# EAGLE board PCB_ICBExt-R1.0-J36-CH01 (EAGLE 6.6.0), part 1 of 2
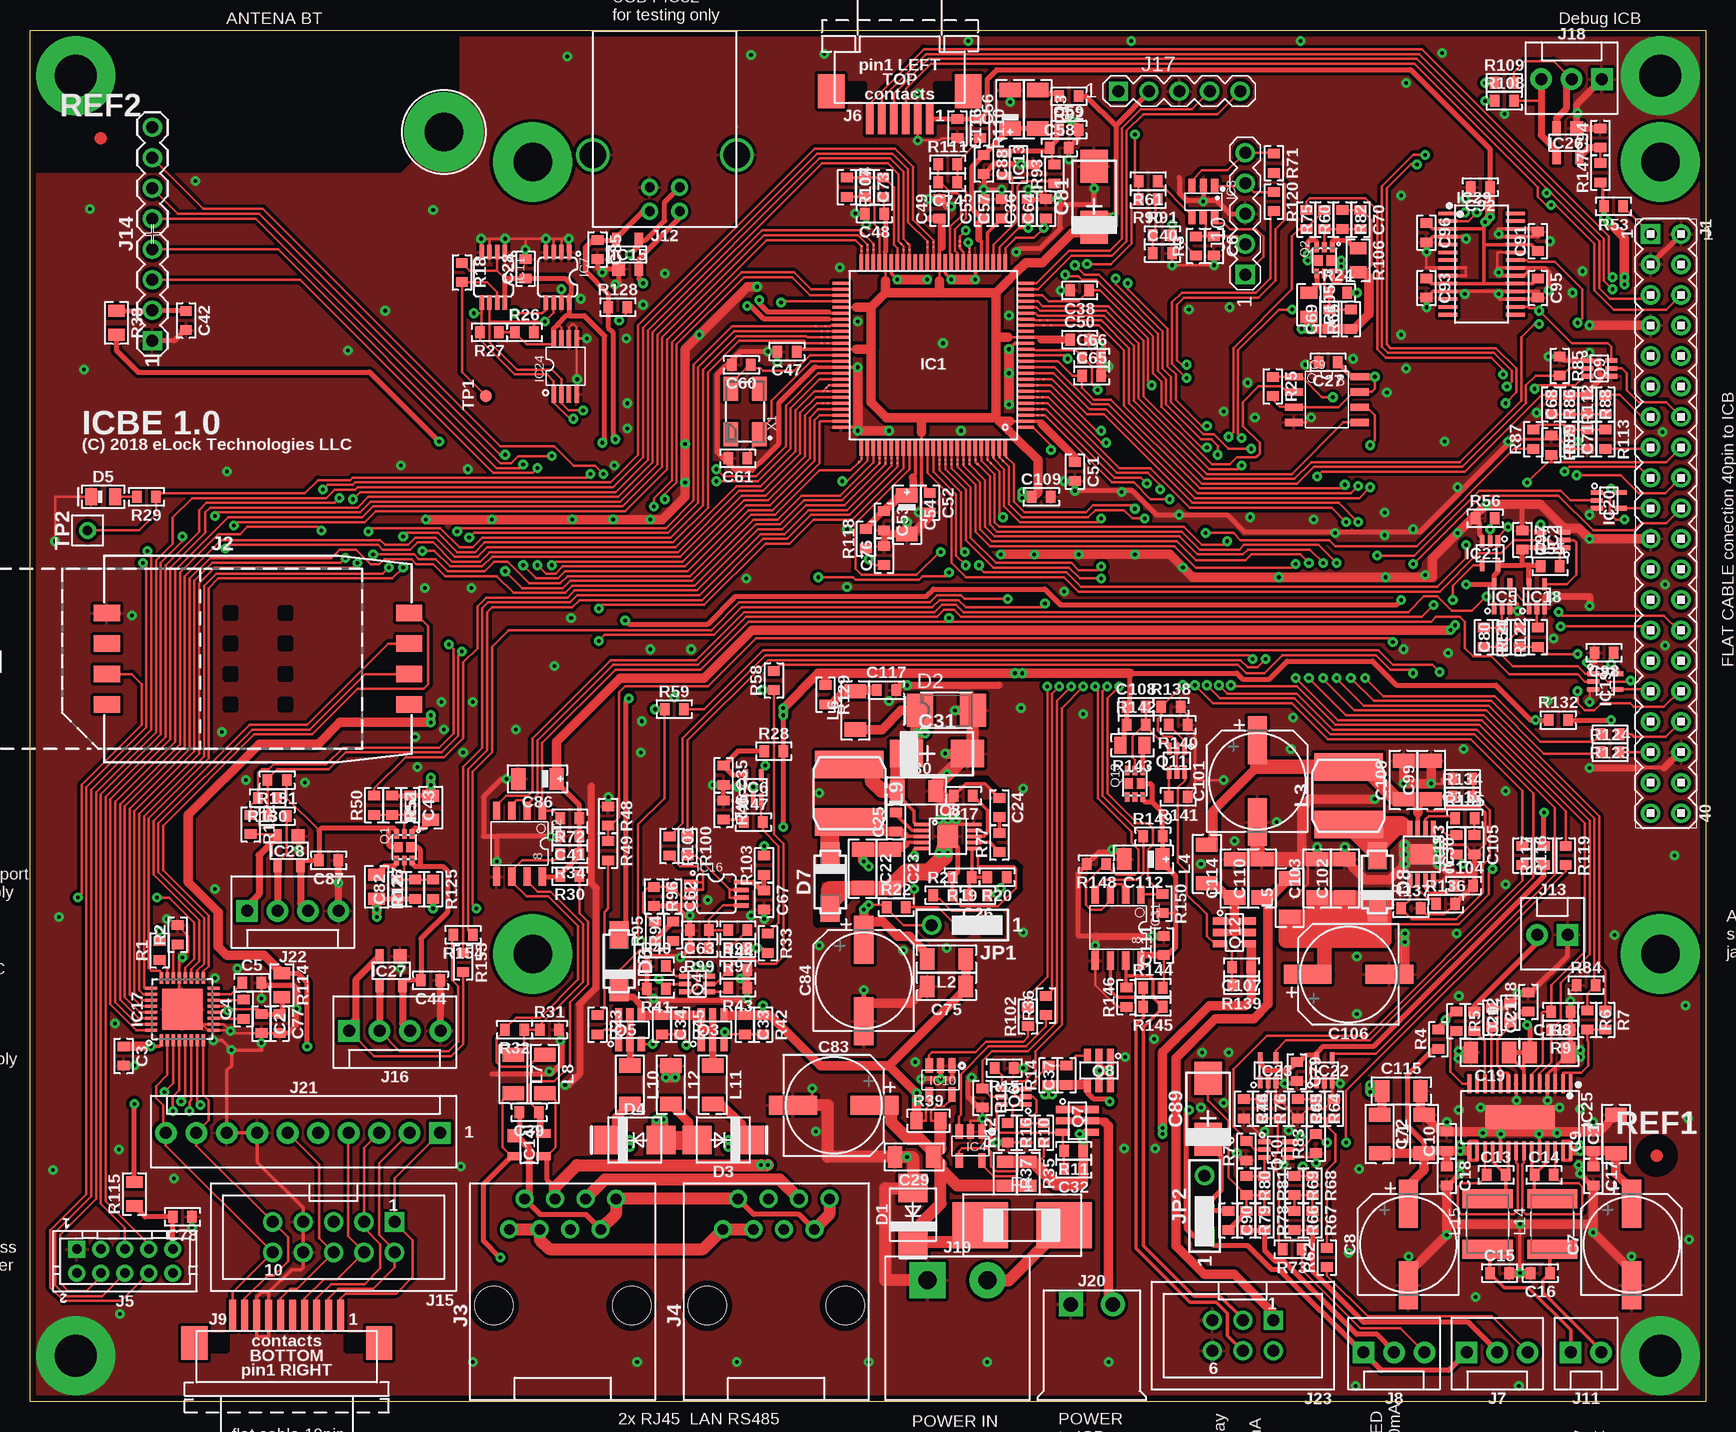
[diagram p7: board, top side]
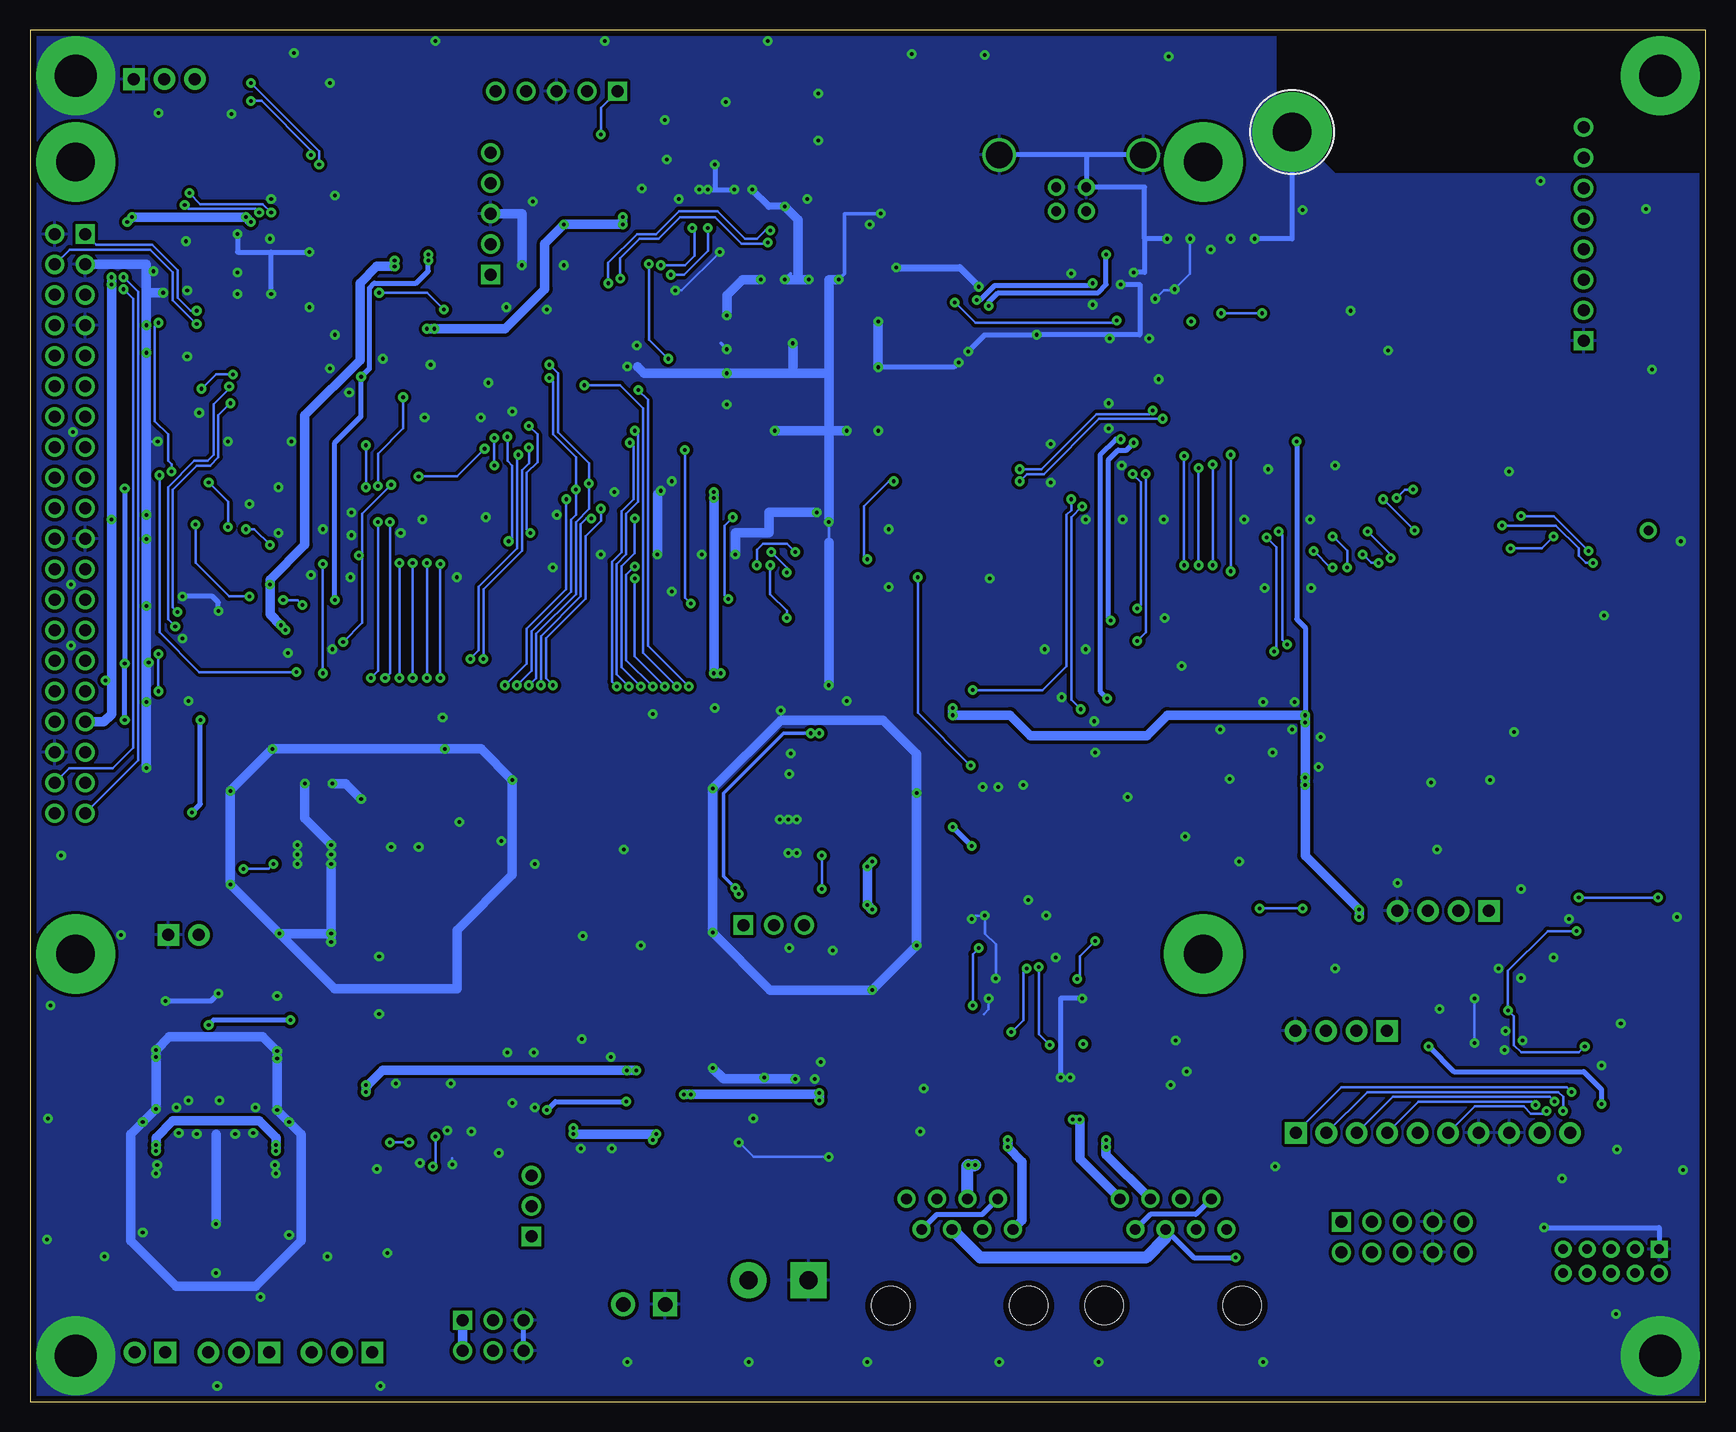
[diagram p8: board, bottom side, seen from below]

Size 139.7 x 114.3 mm. Coordinates in mm from the lower left corner, seen from the top.
Copper layers (1*16): Top 0.035mm / dielectric 1.5mm / Bottom 0.035mm
Design rules "ELOCK-ICBE-PAD-PAD-0,5-WIRE-PAD-0,3 *": minimum track width 0.2mm, minimum drill 0.3mm, track to track 0.2mm, track to pad 0.2mm, pad to pad 0.2mm, via to via 0.2mm, smd to smd 0.001mm, copper to edge 0.49mm, drill to drill 0.2mm, minimum pad ring 0.3mm, minimum via ring 0.25mm, stop-mask expansion 0.1mm, vias tented up to drill 0.6mm, thermal gap 0.27mm
Net classes: 1 HV: clearance 0.3 mm to class 0
tRestrict: area 9.9,107.3 to 30.9,114.3; 34 lines
bRestrict: area 9.9,107.3 to 30.9,114.3

## Footprints (pad centres in the part's own frame; a part is rotated, then mirrored left to right if it is on the bottom)
1206 = smd 1.19 x 1.79: 1 -1.6,0; 2 1.6,0
0603 = smd 0.79 x 0.99: 1 -0.8,0; 2 0.8,0
CAP_8MM_DIA_SMT = smd 1.59 x 3.99: 1 0,3.4; 2 0,-3.4
CT-C = smd 2.743 x 2.311: + -2.54,0; - 2.54,0
1206-POL-C = smd 1.19 x 1.79: + -1.6,0; - 1.6,0
SMB = smd 2.4 x 2.4: A 2.2,0; C -2.2,0
SMA = smd 2.159 x 2.743: + -2.311,0.003; - 2.108,-0.002
0805-POL-D = smd 0.99 x 1.39: A 1,0; K -1,0
SMA' = smd 2.21 x 1.575: A -2.223,0; K 2.223,0
LITTLEFUSE0154 = smd 4.6 x 3.8: 1 3.5,0; 2 -3.5,0
TQFP100_14X14_0,5MM = smd 1.39 x 0.28: 1 -7.7,6; 2 -7.7,5.5; 3 -7.7,5; 4 -7.7,4.5; 5 -7.7,4; 6 -7.7,3.5; 7 -7.7,3; 8 -7.7,2.5; 9 -7.7,2; 10 -7.7,1.5; 11 -7.7,1; 12 -7.7,0.5; 13 -7.7,0; 14 -7.7,-0.5; 15 -7.7,-1; 16 -7.7,-1.5; 17 -7.7,-2; 18 -7.7,-2.5; 19 -7.7,-3; 20 -7.7,-3.5; 21 -7.7,-4; 22 -7.7,-4.5; 23 -7.7,-5; 24 -7.7,-5.5; 25 -7.7,-6; 51 7.7,-6; 52 7.7,-5.5; 53 7.7,-5; 54 7.7,-4.5; 55 7.7,-4; 56 7.7,-3.5; 57 7.7,-3; 58 7.7,-2.5; 59 7.7,-2; 60 7.7,-1.5; 61 7.7,-1; 62 7.7,-0.5; 63 7.7,0; 64 7.7,0.5; 65 7.7,1; 66 7.7,1.5; 67 7.7,2; 68 7.7,2.5; 69 7.7,3; 70 7.7,3.5; 71 7.7,4; 72 7.7,4.5; 73 7.7,5; 74 7.7,5.5; 75 7.7,6 | smd 0.28 x 1.39: 26 -6,-7.7; 27 -5.5,-7.7; 28 -5,-7.7; 29 -4.5,-7.7; 30 -4,-7.7; 31 -3.5,-7.7; 32 -3,-7.7; 33 -2.5,-7.7; 34 -2,-7.7; 35 -1.5,-7.7; 36 -1,-7.7; 37 -0.5,-7.7; 38 0,-7.7; 39 0.5,-7.7; 40 1,-7.7; 41 1.5,-7.7; 42 2,-7.7; 43 2.5,-7.7; 44 3,-7.7; 45 3.5,-7.7; 46 4,-7.7; 47 4.5,-7.7; 48 5,-7.7; 49 5.5,-7.7; 50 6,-7.7; 76 6,7.7; 77 5.5,7.7; 78 5,7.7; 79 4.5,7.7; 80 4,7.7; 81 3.5,7.7; 82 3,7.7; 83 2.5,7.7; 84 2,7.7; 85 1.5,7.7; 86 1,7.7; 87 0.5,7.7; 88 0,7.7; 89 -0.5,7.7; 90 -1,7.7; 91 -1.5,7.7; 92 -2,7.7; 93 -2.5,7.7; 94 -3,7.7; 95 -3.5,7.7; 96 -4,7.7; 97 -4.5,7.7; 98 -5,7.7; 99 -5.5,7.7; 100 -6,7.7
SC70-5,SOT353,TSSOP5 = smd 0.39 x 0.99: 1 -0.65,-1; 2 0,-1; 3 0.65,-1; 4 0.65,1; 5 -0.65,1
SOT23-6 = smd 0.6 x 1.2: 1 -0.95,-1.3; 2 0,-1.3; 3 0.95,-1.3; 4 0.95,1.3; 5 0.003,1.3; 6 -0.95,1.3
SOT23-5 = smd 0.6 x 1.2: 1 -0.95,-1.206; 2 0,-1.206; 3 0.95,-1.206; 4 0.95,1.206; 5 -0.95,1.206
SC-70-5 = smd 0.39 x 0.99: 1 -0.65,-1; 2 0,-1; 3 0.65,-1; 4 0.65,1; 5 -0.65,1
MSOP-08 = smd 0.38 x 1.2: 1 -1,-2.1; 2 -0.35,-2.1; 3 0.3,-2.1; 4 0.95,-2.1; 5 0.95,2.1; 6 0.3,2.1; 7 -0.35,2.1; 8 -1,2.1
MSOP10EXP = smd 0.29 x 1.19: 1 -1,-2.2; 2 -0.5,-2.2; 3 0,-2.2; 4 0.5,-2.2; 5 1,-2.2; 6 1,2.2; 7 0.5,2.2; 8 0,2.2; 9 -0.5,2.2; 10 -1,2.2 | smd 1.88 x 1.68: EP 0,0
SO-08 = smd 0.61 x 1.524: 1 -1.905,-2.743; 2 -0.635,-2.743; 3 0.635,-2.743; 4 1.905,-2.743; 5 1.905,2.743; 6 0.635,2.743; 7 -0.635,2.743; 8 -1.905,2.743
SO08 = smd 0.61 x 1.524: 1 -1.905,-2.743; 2 -0.635,-2.743; 3 0.635,-2.743; 4 1.905,-2.743; 5 1.905,2.743; 6 0.635,2.743; 7 -0.635,2.743; 8 -1.905,2.743
SOT23 = smd 0.69 x 1.19: 1 0.95,1.2; 2 -0.95,1.2; 3 0,-1.2
SOT-143 = smd 1.09 x 1.19: 1 -0.75,-1.2 | smd 0.69 x 1.19: 2 0.95,-1.2; 3 0.95,1.2; 4 -0.95,1.2
QFN32 = smd 0.99 x 0.28: 1 -2.6,1.75; 2 -2.6,1.25; 3 -2.6,0.75; 4 -2.6,0.25; 5 -2.6,-0.25; 6 -2.6,-0.75; 7 -2.6,-1.25; 8 -2.6,-1.75; 17 2.6,-1.75; 18 2.6,-1.25; 19 2.6,-0.75; 20 2.6,-0.25; 21 2.6,0.25; 22 2.6,0.75; 23 2.6,1.25; 24 2.6,1.75 | smd 0.28 x 0.99: 9 -1.75,-2.6; 10 -1.25,-2.6; 11 -0.75,-2.6; 12 -0.25,-2.6; 13 0.25,-2.6; 14 0.75,-2.6; 15 1.25,-2.6; 16 1.75,-2.6; 25 1.75,2.6; 26 1.25,2.6; 27 0.75,2.6; 28 0.25,2.6; 29 -0.25,2.6; 30 -0.75,2.6; 31 -1.25,2.6; 32 -1.75,2.6 | smd 3.4 x 3.4: PAD 0,0
TSSOP08-3 = smd 0.38 x 1.4: 1 -0.94,-2.343; 2 -0.305,-2.343; 3 0.33,-2.343; 4 0.965,-2.343; 5 0.965,2.292; 6 0.33,2.292; 7 -0.305,2.292; 8 -0.94,2.292
TSSOP28_EP = smd 1.59 x 0.3: 1 -2.8,4.225; 2 -2.8,3.575; 3 -2.8,2.925; 4 -2.8,2.275; 5 -2.8,1.625; 6 -2.8,0.975; 7 -2.8,0.325; 8 -2.8,-0.325; 9 -2.8,-0.975; 10 -2.8,-1.625; 11 -2.8,-2.275; 12 -2.8,-2.925; 13 -2.8,-3.575; 14 -2.8,-4.225; 15 2.8,-4.225; 16 2.8,-3.575; 17 2.8,-2.925; 18 2.8,-2.275; 19 2.8,-1.625; 20 2.8,-0.975; 21 2.8,-0.325; 22 2.8,0.325; 23 2.8,0.975; 24 2.8,1.625; 25 2.8,2.275; 26 2.8,2.925; 27 2.8,3.575; 28 2.8,4.225 | smd 1.99 x 5.79: EP 0,0
TSSOP28 = smd 1.59 x 0.3: 1 -2.8,4.225; 2 -2.8,3.575; 3 -2.8,2.925; 4 -2.8,2.275; 5 -2.8,1.625; 6 -2.8,0.975; 7 -2.8,0.325; 8 -2.8,-0.325; 9 -2.8,-0.975; 10 -2.8,-1.625; 11 -2.8,-2.275; 12 -2.8,-2.925; 13 -2.8,-3.575; 14 -2.8,-4.225; 15 2.8,-4.225; 16 2.8,-3.575; 17 2.8,-2.925; 18 2.8,-2.275; 19 2.8,-1.625; 20 2.8,-0.975; 21 2.8,-0.325; 22 2.8,0.325; 23 2.8,0.975; 24 2.8,1.625; 25 2.8,2.275; 26 2.8,2.925; 27 2.8,3.575; 28 2.8,4.225
MSOP8EXP = smd 0.39 x 1.19: 1 -0.975,-2.2; 2 -0.325,-2.2; 3 0.325,-2.2; 4 0.975,-2.2; 5 0.975,2.2; 6 0.325,2.2; 7 -0.325,2.2; 8 -0.975,2.2 | smd 1.88 x 1.68: EP 0,0
MA20-2 = drill 1 pad 1.6 square: 1 -24.13,-1.27 | drill 1 pad 1.6: 2 -24.13,1.27; 3 -21.59,-1.27; 4 -21.59,1.27; 5 -19.05,-1.27; 6 -19.05,1.27; 7 -16.51,-1.27; 8 -16.51,1.27; 9 -13.97,-1.27; 10 -13.97,1.27; 11 -11.43,-1.27; 12 -11.43,1.27; 13 -8.89,-1.27; 14 -8.89,1.27; 15 -6.35,-1.27; 16 -6.35,1.27; 17 -3.81,-1.27; 18 -3.81,1.27; 19 -1.27,-1.27; 20 -1.27,1.27; 21 1.27,-1.27; 22 1.27,1.27; 23 3.81,-1.27; 24 3.81,1.27; 25 6.35,-1.27; 26 6.35,1.27; 27 8.89,-1.27; 28 8.89,1.27; 29 11.43,-1.27; 30 11.43,1.27; 31 13.97,-1.27; 32 13.97,1.27; 33 16.51,-1.27; 34 16.51,1.27; 35 19.05,-1.27; 36 19.05,1.27; 37 21.59,-1.27; 38 21.59,1.27; 39 24.13,-1.27; 40 24.13,1.27
CCM03-3504LFT-JK = smd 2.2 x 1.4: C1 12.6,3.81; C2 12.6,1.27; C3 12.6,-1.27; C4 12.6,-3.81; C5 -12.6,3.81; C6 -12.6,1.27; C7 -12.6,-1.27; C8 -12.6,-3.81
RJ8-8-90-DOWN = drill 0.9 pad 1.4: 1 -4.445,6.35; 2 -3.175,8.89; 3 -1.905,6.35; 4 -0.635,8.89; 5 0.635,6.35; 6 1.905,8.89; 7 3.175,6.35; 8 4.445,8.89 | hole 3.2: 5.75,0; -5.75,0
DF11-10DP-2DSA = drill 0.8 pad 1.3 square: 1 4,-1 | drill 0.8 pad 1.3: 2 4,1; 3 2,-1; 4 2,1; 5 0,-1; 6 0,1; 7 -2,-1; 8 -2,1; 9 -4,-1; 10 -4,1
5220706/1.LEFT = smd 0.6 x 2.6: 1 -2.5,3.3; 2 -1.5,3.3; 3 -0.5,3.3; 4 0.5,3.3; 5 1.5,3.3; 6 2.5,3.3 | smd 2.2 x 2.8: C1 -5.7,1; C2 5.7,1
3-641215-3 = drill 1 pad 1.8 square: 1 2.54,0 | drill 1 pad 1.8: 2 0,0; 3 -2.54,0
5227110/1.RIGHT = smd 0.6 x 2.6: 1 4.5,3.3; 2 3.5,3.3; 3 2.5,3.3; 4 1.5,3.3; 5 0.5,3.3; 6 -0.5,3.3; 7 -1.5,3.3; 8 -2.5,3.3; 9 -3.5,3.3; 10 -4.5,3.3 | smd 2.2 x 2.8: C1 -7.7,1; C2 7.7,1
MA05-1 = drill 1 pad 1.6 square: 1 -5.08,0 | drill 1 pad 1.6: 2 -2.54,0; 3 0,0; 4 2.54,0; 5 5.08,0
3-641215-2 = drill 1 pad 1.8 square: 1 1.27,0 | drill 1 pad 1.8: 2 -1.27,0
USB_B_90 = drill 0.8 pad 1.4: 1_+5V 1.25,4.7; 2_D- -1.25,4.7; 3_D+ -1.25,2.7; 4_GND 1.25,2.7 | drill 2.2 pad 2.8: SH1 -6,0; SH2 6,0
MA08-1-MALE = drill 1 pad 1.6 square: 1 -8.89,0 | drill 1 pad 1.6: 2 -6.35,0; 3 -3.81,0; 4 -1.27,0; 5 1.27,0; 6 3.81,0; 7 6.35,0; 8 8.89,0
MLW10-5X2-PRIMY = drill 1 pad 1.6 square: 1 -5.08,-1.27 | drill 1 pad 1.6: 2 -5.08,1.27; 3 -2.54,-1.27; 4 -2.54,1.27; 5 0,-1.27; 6 0,1.27; 7 2.54,-1.27; 8 2.54,1.27; 9 5.08,-1.27; 10 5.08,1.27
3-641215-4 = drill 1 pad 1.8 square: 1 3.81,0 | drill 1 pad 1.8: 2 1.27,0; 3 -1.27,0; 4 -3.81,0
796644-2-5MM = drill 1.5 pad 3 square: 1 2.5,0 | drill 1.5 pad 3: 2 -2.5,0
284512-2-3,5MM = drill 1.2 pad 2 square: 1 1.75,0 | drill 1.2 pad 2: 2 -1.75,0
4-641215-0 = drill 1 pad 1.8 square: 1 11.38,0 | drill 1 pad 1.8: 2 8.84,0; 3 6.3,0; 4 3.76,0; 5 1.22,0; 6 -1.32,0; 7 -3.86,0; 8 -6.4,0; 9 -8.94,0; 10 -11.48,0
MLW06-3X2-PRIMY = drill 1 pad 1.6 square: 1 -2.54,-1.27 | drill 1 pad 1.6: 2 -2.54,1.27; 3 0,-1.27; 4 0,1.27; 5 2.54,-1.27; 6 2.54,1.27
JP3CLOSE12 = drill 1 pad 1.626 square: 1 -2.54,0 | drill 1 pad 1.626: 2 0,0; 3 2.54,0
NR6028 = smd 2.3 x 5.7: 1 2.4,0; 2 -2.4,0
L1812 = smd 1.59 x 4.19: 1 -2.1,0; 2 2.1,0
TEMP-PAD = smd 0.2 x 0.2: P$1 0,0
PCB-ICBE = drill 3.5 pad 6.6: 1 -3.01,-30.49; 2 -135.09,-30.49; 3 -135.09,76.19; 4 -3.01,76.19
PCB-ICB = drill 3.2 pad 6.6: 1 -3,3; 2 -97,3; 3 -97,69; 4 -3,69
BT_MODULE_BRD = drill 3.2 pad 6.6: 1 25.5,20.5
MICRO_FET = smd 0.4 x 0.8: 1 -0.65,-1.1; 2 0,-1.1; 3 0.65,-1.1; 4 0.65,1.1; 5 0,1.1; 6 -0.65,1.1 | smd 0.7 x 0.86: P1 -0.5,0; P2 0.5,0
SSOT-6 = smd 0.6 x 1.2: 1 -0.95,-1.2; 2 0,-1.2; 3 0.95,-1.206; 4 0.95,1.2; 5 0,1.2; 6 -0.95,1.2
SC70-6 = smd 0.39 x 0.99: 1 -0.65,-1; 2 0,-1; 3 0.65,-1; 4 0.65,1; 5 0,1; 6 -0.65,1
0805 = smd 0.99 x 1.39: 1 -1,0; 2 1,0
SMD_ROUND_1MM = smd 1 x 1: P$1 0,0
TH_ROUND_14MM08MM = drill 0.8 pad 1.4: P$1 0,0
7B = smd 2 x 1.2: 1 -1.9,-1.2; 2 1.9,-1.2; 3 1.9,1.2; 4 -1.9,1.2

## Placement (x,y rotation side)
C1  4u7/50  [1206]  132.2,22.3 90 top
C2  100n  [0603]  19.3,31.5 270 top
C3  10u  [0603]  7.8,28.8 270 top
C4  1u  [0603]  17.8,32.7 90 top
C5  10u  [0603]  18.5,34.9 0 top
C6  10u  [0603]  98.7,96.3 270 top
C7  220u/25V  [CAP_8MM_DIA_SMT]  133.5,13.1 0 top
C8  220u/25V  [CAP_8MM_DIA_SMT]  114.9,13.1 0 top
C9  1n  [0603]  130.3,21.7 90 top
C10  1n  [0603]  118.1,21.7 90 top
C11  4u7/50  [1206]  126.6,29.1 0 top
C12  1u  [0603]  123.4,32.4 90 top
C13  470n/25  [0603]  122.2,18.9 0 top
C14  470n/25  [0603]  126.2,18.9 0 top
C15  1n  [0603]  122.5,10.7 0 top
C16  1n  [0603]  125.9,10.7 180 top
C17  100n  [0603]  130.3,18.8 270 top
C18  100n  [0603]  118.1,18.8 270 top
C19  4u7/50  [1206]  121.7,29.1 180 top
C20  1u  [0603]  120.4,31.7 270 top
C21  1u  [0603]  121.9,32 270 top
C22  4u7/50  [1206]  69.4,44.4 270 top
C23  4u7/50  [1206]  71.7,44.4 270 top
C24  1n  [0603]  80.8,49.5 270 top
C25  470n/25  [0603]  72.2,48.3 90 top
C26  10p  [0603]  79,42.2 180 top
C27  10u  [0603]  108.2,86.6 180 top
C28  1u  [0603]  41.3,94.4 90 top
C29  4u7/50  [1206]  73.7,20.4 180 top
C30  47u/6.3  [1206]  73.9,50.9 0 top
C31  47uTC  [CT-C]  75.6,54 0 top
C32  100n  [0603]  87,19.4 180 top
C33  100n  [0603]  59.6,31.4 270 top
C34  1n  [0603]  52.7,31.4 270 top
C35  1u  [0603]  57.8,52.2 270 top
C36  100n  [0603]  83.2,99.4 90 top
C37  1n  [0603]  86.4,27.2 90 top
C38  10n  [0603]  87.5,92.6 180 top
C39  100n  [0603]  41.6,24.1 180 top
C40  100n  [0603]  94.4,95.7 0 top
C41  100n  [0603]  45,47.1 180 top
C42  10u  [0603]  13,90.1 270 top
C43  1n  [0603]  31.7,49.7 270 top
C44  10u  [0603]  33.4,35.1 180 top
C45  100n  [0603]  105.7,24.4 270 top
C46  100n  [0603]  101.2,24.4 270 top
C47  10u  [0603]  63.1,87.5 180 top
C48  100n  [0603]  70.4,99 180 top
C49  10u  [0603]  75.8,99.4 90 top
C50  100n  [0603]  87.5,88.5 0 top
C51  10u  [0603]  87.1,77.5 270 top
C52  100n  [0603]  75,74.9 270 top
C53  10u  [0603]  71.2,73.4 270 top
C54  10uTA  [1206-POL-C]  73.1,73.9 270 top
C55  100n  [0603]  79.5,99.4 90 top
C56  10uTA  [1206-POL-C]  81.7,107.7 90 top
C57  10n  [0603]  81,99.4 90 top
C58  100n  [0603]  85.8,104.5 0 top
C59  100n  [0603]  86.6,106 0 top
C60  18p  [0603]  59.3,86.4 180 top
C61  18p  [0603]  59,78.6 180 top
C62  1n  [0603]  53.5,42.1 270 top
C63  1n  [0603]  55.8,39.3 180 top
C64  100n  [0603]  84.7,99.4 90 top
C65  1n  [0603]  88.5,85.5 0 top
C66  10n  [0603]  88.5,87 0 top
C67  10u  [0603]  61.2,41.8 270 top
C68  1n  [0603]  128.3,83.1 90 top
C69  1n  [0603]  108.3,90.2 90 top
C70  10n  [0603]  110.9,98.5 270 top
C71  1n  [0603]  128.3,80.2 270 top
C72  4u7/50  [1206]  116.2,22.3 90 top
C73  10n  [0603]  69.6,101.2 270 top
C74  10n  [0603]  76.5,101.6 180 top
C75  4u7/50  [1206]  76.4,34.6 180 top
C76  10n  [0603]  71.2,70.5 90 top
C77  10u  [0603]  20.8,31.5 270 top
C78  10u  [0603]  12.7,15.4 180 top
C79  10u  [0603]  105.6,27.5 270 top
C80  10n  [0603]  122.7,63.7 90 top
C81  47uTC  [CT-C]  88.7,100.4 90 top
C82  1n  [0603]  30.6,42.7 90 top
C83  220u/25V  [CAP_8MM_DIA_SMT]  67,24.7 270 top
C84  220u/25V  [CAP_8MM_DIA_SMT]  69.5,35.1 0 top
C85  100n  [0603]  47.3,96 270 top
C86  10uTA  [1206-POL-C]  42.3,51.9 180 top
C87  10u  [0603]  24.9,45.1 180 top
C88  10u  [0603]  79.5,103.1 270 top
C89  47uTC  [CT-C]  98.2,24.4 90 top
C90  100n  [0603]  99.9,15.1 270 top
C91  100n  [0603]  125.7,96.7 90 top
C92  10u  [0603]  120.9,101.2 180 top
C93  100n  [0603]  116.4,92.8 270 top
C94  100n  [0603]  130.9,105.3 90 top
C95  10n  [0603]  125.7,92.8 270 top
C96  10n  [0603]  116.4,97.4 270 top
C97  1u  [0603]  124.4,71.8 270 top
C98  10u  [0603]  131.2,62.4 180 top
C99  4u7/50  [1206]  116.8,51.8 90 top
C100  4u7/50  [1206]  114.5,51.8 90 top
C101  220u/25V  [CAP_8MM_DIA_SMT]  102.3,51.7 0 top
C102  4u7/50  [1206]  109.6,43.6 90 top
C103  4u7/50  [1206]  107.3,43.6 90 top
C104  1u  [0603]  119.5,43 0 top
C105  1n  [0603]  120.4,46.4 270 top
C106  220u/35V  [CAP_8MM_DIA_SMT]  109.9,35.6 90 top
C107  100n  [0603]  101,36.2 180 top
C108  10n  [0603]  92.2,57.9 0 top
C109  10u  [0603]  84.3,75.4 0 top
C110  4u7/50  [1206]  102.7,43.6 90 top
C111  100n  [0603]  94.5,38 90 top
C112  10uTA  [1206-POL-C]  92.8,45.2 180 top
C113  10n  [0603]  119.4,51.9 180 top
C114  4u7/50  [1206]  100.4,43.6 90 top
C115  4u7/50  [1206]  114.3,25.9 0 top
C116  10u  [0603]  77.3,106.1 270 top
C117  10u  [0603]  71.4,59.3 0 top
C118  1u  [0603]  124.9,33.3 90 top
D1  P6SMB20A  [SMB]  73.6,15.6 90 top
D2  SMLVT3V3  [SMA]  76.5,57.6 0 top
D3  P6SMB20A  [SMB]  57.8,21.8 180 top
D4  P6SMB20A  [SMB]  50.4,21.8 0 top
D5  LED-GREEN  [0805-POL-D]  6.1,75.4 0 top
D6  SS14  [SMA']  49.1,36.7 270 top
D7  SS14  [SMA']  66.7,43.3 90 top
D8  SS14  [SMA']  112.3,43.3 270 top
F1  T2A-LITTLEFUSE0154  [LITTLEFUSE0154]  82.7,14.7 0 top
IC1  PIC32MX470F512L-I/PF  [TQFP100_14X14_0,5MM]  75.3,87.2 180 top
IC2  AHC1G08_DC/GW/SE  [SC70-5,SOT353,TSSOP5]  126.9,71.8 90 top
IC3  PIC10F200T-I/OT  [SOT23-6]  97.8,100 180 top
IC4  MAX9938HEUK+T  [SOT23-5]  78.4,21.3 180 top
IC5  AHC1G14_DC/GW/SE  [SC70-5,SOT353,TSSOP5]  122.7,67.1 0 top
IC6  MIC841LYC  [SC-70-5]  60.3,51.2 0 top
IC7  24LC32A-I/MS  [MSOP-08]  43.95,93.7 180 top
IC8  LT3971EMSE  [MSOP10EXP]  76.5,47.1 270 top
IC9  AT25SF321-SSHD  [SO-08]  108.1,83.5 270 top
IC10  MAX9938HEUK+T  [SOT23-5]  75.9,26.8 180 top
IC11  24LC32A-I/MS  [MSOP-08]  38.6,93.7 180 top
IC12  SN65HVD12D  [SO08]  40.8,46.5 180 top
IC13  REF3025  [SOT23]  82.4,103.1 90 top
IC14  TPD2E001DZDR  [SOT-143]  41.6,21.4 270 top
IC15  TPD2E001DZDR  [SOT-143]  49.8,95.6 0 top
IC16  MCP6042-I/MS  [MSOP-08]  57.2,42.3 270 top
IC17  LTC1955_EUH  [QFN32]  12.7,32.7 90 top
IC18  AHC1G32_DC/GW/SE  [SC70-5,SOT353,TSSOP5]  125.6,67.1 0 top
IC19  AHC1G08_DC/GW/SE  [SC70-5,SOT353,TSSOP5]  131.3,60 270 top
IC20  AHC1G08_DC/GW/SE  [SC70-5,SOT353,TSSOP5]  131.6,75.1 270 top
IC21  AHC1G32_DC/GW/SE  [SC70-5,SOT353,TSSOP5]  121.7,70.7 180 top
IC22  AHC1G14_DC/GW/SE  [SC70-5,SOT353,TSSOP5]  107.9,27.6 0 top
IC23  AHC1G14_DC/GW/SE  [SC70-5,SOT353,TSSOP5]  103.2,27.6 0 top
IC24  LM75ADP  [TSSOP08-3]  44.6,86.3 0 top
IC25  TPA3111D1PWP  [TSSOP28_EP]  124.2,23.7 270 top
IC26  TPD2E001DZDR  [SOT-143]  128.2,104.9 180 top
IC27  TPD2E001DZDR  [SOT-143]  30.1,35.9 180 top
IC28  TPD2E001DZDR  [SOT-143]  21.6,45.9 180 top
IC29  AT97SC3205T-U3A1C20B  [TSSOP28]  121,94.8 0 top
IC30  LT3580EMS8E  [MSOP8EXP]  116,45.6 180 top
IC31  SN65HVD12D  [SO08]  90.7,39.5 180 top
J1  MA20-2-ICB-EXT  [MA20-2]  136.36,73.17 270 top
J2  CCM03-3504LFT-JK  [CCM03-3504LFT-JK]  19,61.9 0 top
J3  RJ8-8-90-DOWN  [RJ8-8-90-DOWN]  44.4,8 0 top
J4  RJ8-8-90-DOWN  [RJ8-8-90-DOWN]  62.2,8 0 top
J5  DF11-10DP-2DSA(01)  [DF11-10DP-2DSA]  7.9,11.7 180 top
J6  5220706  [5220706/1.LEFT]  72.5,110.2 180 top
J7  3-641215-3  [3-641215-3]  122.3,4.1 180 top
J8  3-641215-3  [3-641215-3]  113.7,4.1 180 top
J9  5227110  [5227110/1.RIGHT]  21.4,3.9 0 top
J10  DNP-open-hole  [MA05-1]  101.3,99 90 top
J11  3-641215-2  [3-641215-2]  129.7,4.1 180 top
J12  USB_B_90  [USB_B_90]  52.9,103.9 180 top
J13  3-641215-2  [3-641215-2]  126.9,38.9 0 top
J14  pin1x8  [MA08-1-MALE]  10.2,97.3 90 top
J15  MLW10G/T821106A1S  [MLW10-5X2-PRIMY]  25.3,13.7 180 top
J16  3-641215-4  [3-641215-4]  30.4,30.9 180 top
J17  DNP-open-hole  [MA05-1]  95.8,109.2 0 top
J18  3-641215-3  [3-641215-3]  128.5,110.2 0 top
J19  796644-2(5mm)  [796644-2-5MM]  77.3,10.1 180 top
J20  284512-2(3.5mm)  [284512-2-3,5MM]  88.5,8.1 180 top
J21  4-641215-0  [4-641215-0]  22.8,22.4 0 top
J22  3-641215-4  [3-641215-4]  21.9,40.9 180 top
J23  MLW06G/T821106A1S  [MLW06-3X2-PRIMY]  101.1,5.5 180 top
JP1  JP3CLOSE12  [JP3CLOSE12]  77.7,39.7 180 top
JP2  JP3CLOSE12  [JP3CLOSE12]  97.9,16.3 90 top
L1  HI1206T500R  [1206]  112.5,22.3 270 top
L2  HI1206T500R  [1206]  76.4,36.9 180 top
L3  NR6028T4R7M  [NR6028]  109.9,50.5 90 top
L4  HI1206T500R  [1206]  98.1,44.8 90 top
L5  HI1206T500R  [1206]  105,42 90 top
L6  HI1206T500R  [1206]  68.8,57.6 90 top
L7  HI1206T500R  [1206]  40.3,27.3 270 top
L8  HI1206T500R  [1206]  42.9,27.3 270 top
L9  NR6028T4R7M  [NR6028]  68.3,50.7 270 top
L10  HI1206T500R  [1206]  50,26.4 270 top
L11  HI1206T500R  [1206]  56.9,26.4 270 top
L12  HI1206T500R  [1206]  53.4,26.4 270 top
L13  HI1206T500R  [1206]  84,107.7 270 top
L14  HI1812V101R-10  [L1812]  126.9,14.8 90 top
L15  HI1812V101R-10  [L1812]  121.5,14.8 90 top
O1  PIC-RPX  [TEMP-PAD]  84,82.2 0 top
O2  PIC-RPX  [TEMP-PAD]  84,83.7 90 top
O3  PIC-OUT  [TEMP-PAD]  78.8,78.5 0 top
O4  PIC-OUT  [TEMP-PAD]  78.3,78.5 0 top
O5  PIC-RPX  [TEMP-PAD]  84,85.2 90 top
O6  PIC-OUT  [TEMP-PAD]  84,83.2 0 top
O7  PIC-OUT  [TEMP-PAD]  84,82.7 0 top
O8  PIC-RPX  [TEMP-PAD]  80.8,78.7 180 top
O9  PIC-OUT  [TEMP-PAD]  77.8,78.5 0 top
O10  PIC-RPX  [TEMP-PAD]  84.5,89.7 90 top
O11  PIC-RPX  [TEMP-PAD]  84.2,90.1 90 top
O12  PIC-OUT  [TEMP-PAD]  77.3,78.5 0 top
O13  PIC-OUT  [TEMP-PAD]  76.8,78.5 0 top
O14  PIC-RPX  [TEMP-PAD]  76.3,78.5 0 top
O15  PIC-RPX  [TEMP-PAD]  75.8,78.5 0 top
O16  PIC-RPX  [TEMP-PAD]  72.3,78.2 0 top
O17  PIC-OUT  [TEMP-PAD]  75.3,96.2 90 top
O18  PIC-RPX  [TEMP-PAD]  74.8,96.2 90 top
O19  PIC-RPX  [TEMP-PAD]  66.5,89.2 0 top
O20  PIC-RPX  [TEMP-PAD]  69.8,96 90 top
O21  PIC-RPX  [TEMP-PAD]  69.3,95.9 90 top
O22  PIC-RPX  [TEMP-PAD]  71.8,78.6 0 top
O23  PIC-RPX  [TEMP-PAD]  84,84.2 0 top
O24  PIC-RPX  [TEMP-PAD]  66.5,83.2 0 top
O25  PIC-RPX  [TEMP-PAD]  66.5,84.2 0 top
O26  PIC-RPX  [TEMP-PAD]  66.6,84.7 0 top
O27  PIC-RPX  [TEMP-PAD]  70.8,78.6 0 top
O28  PIC-RPX  [TEMP-PAD]  66.3,89.6 0 top
O29  PIC-OUT  [TEMP-PAD]  80.1,78.2 0 top
O30  PIC-OUT  [TEMP-PAD]  71.3,78.2 0 top
O31  PIC-RPX  [TEMP-PAD]  84,84.7 0 top
O32  PIC-RPX  [TEMP-PAD]  81.4,78.7 0 top
O33  PIC-RPX  [TEMP-PAD]  80.3,78.7 0 top
O35  PIC-RPX  [TEMP-PAD]  69.3,78.6 90 top
O39  PIC-OUT  [TEMP-PAD]  66.5,88.2 90 top
O40  PIC-OUT  [TEMP-PAD]  66.5,88.7 90 top
O53  PIC-RPX  [TEMP-PAD]  72.8,96 0 top
O55  PIC-OUT  [TEMP-PAD]  73.3,96 0 top
O58  PIC-OUT  [TEMP-PAD]  70.3,96 0 top
O59  PIC-RPX  [TEMP-PAD]  78.3,96.1 0 top
O60  PIC-RPX  [TEMP-PAD]  77.5,96.3 0 top
PCB1  PCB-ICBE  [PCB-ICBE]  138.9,34.3 0 top
PCB2  DNP-PCB-ICB  [PCB-ICB]  138.9,34.3 0 top
PCB3  DNP-PCB-BT  [BT_MODULE_BRD]  9,85.3 0 top
Q1  SSM6P49NU,LFPZ  [MICRO_FET]  31.2,46.2 180 top
Q2  SSM6P49NU,LFPZ  [MICRO_FET]  107.9,95.1 180 top
Q3  Si3421DV  [SSOT-6]  56.9,31 0 top
Q4  FDG6303N  [SC70-6]  55.6,34.8 270 top
Q5  Si3421DV  [SSOT-6]  50,31 0 top
Q6  FDG6303N  [SC70-6]  82,25.4 90 top
Q7  Si3421DV  [SSOT-6]  87.3,23.4 270 top
Q8  Si3421DV  [SSOT-6]  89.1,27.6 180 top
Q9  FDG6303N  [SC70-6]  130.8,86.1 270 top
Q10  FDG6303N  [SC70-6]  103.9,21 270 top
Q11  FDG6303N  [SC70-6]  95.6,53.4 180 top
Q12  Si3421DV  [SSOT-6]  100.4,39.1 270 top
Q13  SSM6P49NU,LFPZ  [MICRO_FET]  92.1,51.5 180 top
R1  300k  [0603]  10.8,37.6 90 top
R2  0R  [0603]  12.3,38.9 90 top
R3  100R  [0603]  97.2,96.3 90 top
R4  10R  [0603]  117.4,30.2 90 top
R5  100k  [0603]  118.9,31.7 270 top
R6  100k  [0603]  129.8,31.8 270 top
R7  100k  [0603]  131.3,31.8 270 top
R8  100k  [0603]  127.6,32.5 180 top
R9  100k  [0603]  127.6,31 180 top
R10  1M  [0603]  83,22.4 270 top
R11  1M  [0603]  87,20.9 180 top
R12  300k  [0603]  81.5,22.4 90 top
R13  1M  [0603]  79.4,25.3 270 top
R14  1M  [0603]  84.9,27.2 90 top
R15  300k  [0603]  81.2,27.8 180 top
R16  1M  [0603]  84.5,22.4 90 top
R17  47k  [0603]  77.8,50.5 180 top
R18  10k  [0603]  36,94.1 270 top
R19  560k  [0603]  77.7,43.7 180 top
R20  1M  [0603]  80.6,43.7 180 top
R21  1M  [0603]  76.1,42.2 0 top
R22  4M99  [0603]  72.2,41.2 0 top
R23  1M  [0603]  47.3,31.4 270 top
R24  100k  [0603]  109,92.4 0 top
R25  1M  [0603]  103.6,84.6 270 top
R26  10k  [0603]  41.2,89.1 0 top
R27  10k  [0603]  38.3,89.1 180 top
R28  100R  [0603]  62,54.2 0 top
R29  300R  [0603]  9.7,75.4 180 top
R30  10k  [0603]  45,43.8 180 top
R31  1M  [0603]  43.3,31 0 top
R32  1M  [0603]  40.4,31 180 top
R33  1M  [0603]  61.5,38.2 270 top
R34  1M  [0603]  45,45.6 180 top
R35  0.025R  [0805]  83.2,19 270 top
R36  1k  [0603]  84.7,33 90 top
R37  0.025R  [0805]  81.3,19 270 top
R38  1R  [0805]  7.2,89.9 270 top
R39  0.025R  [0805]  74.9,23.4 0 top
R40  300k  [0603]  52.2,36.3 0 top
R41  300k  [0603]  52.2,34.4 180 top
R42  1M  [0603]  61.1,31.4 270 top
R43  300k  [0603]  59,34.5 180 top
R44  300k  [0603]  59,36 0 top
R45  1M  [0603]  54.2,31.4 270 top
R46  150k  [0603]  57.8,49.3 270 top
R47  47k  [0603]  60.3,48.3 0 top
R48  1M  [0603]  48.2,48.8 270 top
R49  560k  [0603]  48.2,45.9 270 top
R50  100k  [0603]  28.7,49.7 90 top
R51  1M  [0603]  30.2,49.7 270 top
R52  1R  [0805]  33.4,49.5 90 top
R53  10k  [0603]  132,99.6 180 top
R54  300k  [0603]  124.2,63.7 90 top
R55  100k  [0603]  126.7,69.6 0 top
R56  100k  [0603]  121.3,73.6 0 top
R57  100k  [0603]  126.8,79.7 270 top
R58  10k  [0603]  62,60.1 90 top
R59  10k  [0603]  53.7,57.7 0 top
R60  10k  [0603]  106.4,98.5 270 top
R61  100R  [0603]  93.2,101.7 180 top
R62  2k2  [0603]  108.1,12 90 top
R63  1k  [0603]  108.7,24.4 90 top
R64  300k  [0603]  107.2,24.4 270 top
R65  1M  [0603]  110.1,90.2 90 top
R66  1k  [0603]  105.4,15.1 270 top
R67  1k  [0603]  106.9,15.1 270 top
R68  1k  [0603]  106.9,18 270 top
R69  1k  [0603]  105.4,18 270 top
R70  1M  [0603]  101.4,20.9 90 top
R71  10k  [0603]  103.7,103.2 270 top
R72  100k  [0603]  45,48.6 180 top
R73  2k2  [0603]  105.2,12.7 180 top
R74  1k  [0603]  104.2,24.4 90 top
R75  10k  [0603]  107.9,98.5 90 top
R76  300k  [0603]  102.7,24.4 270 top
R77  47k  [0603]  80.8,46.6 90 top
R78  100R  [0603]  102.9,15.1 270 top
R79  100R  [0603]  101.4,15.1 270 top
R80  100R  [0603]  101.4,18 270 top
R81  100R  [0603]  102.9,18 270 top
R82  100k  [0603]  109.4,98.5 270 top
R83  1M  [0603]  107.2,21.5 90 top
R84  300k  [0603]  129.7,34.7 0 top
R85  1M  [0603]  127.5,86.3 270 top
R86  1k  [0603]  126.8,83.1 270 top
R87  1k  [0603]  125.3,80.2 90 top
R88  1M  [0603]  129.8,83.1 270 top
R89  1M  [0603]  129.8,80.2 90 top
R90  1k  [0603]  93.2,100.2 180 top
R91  10k  [0603]  94.4,97.2 0 top
R92  10R  [0603]  86.6,108.8 180 top
R93  300R  [0603]  85.4,102.3 90 top
R94  180k  [0603]  53.6,39.2 90 top
R95  4M99  [0603]  52.1,39.2 90 top
R96  560k  [0603]  52,42.1 270 top
R97  180k  [0603]  59,37.8 180 top
R98  4M99  [0603]  59,39.3 180 top
R99  560k  [0603]  55.8,37.8 180 top
R100  2k2  [0603]  54.8,46.3 270 top
R101  2k2  [0603]  53.3,46.3 270 top
R102  1k  [0603]  83.2,32.1 90 top
R103  300R  [0603]  61.2,44.7 90 top
R104  10k  [0603]  71.1,101.2 90 top
R105  1R  [0805]  106.6,91.4 270 top
R106  1R  [0805]  110.7,95.1 270 top
R107  10k  [0603]  68.1,101.2 270 top
R108  100R  [0603]  122.9,108.4 0 top
R109  100R  [0603]  122.9,109.9 0 top
R110  10k  [0603]  79.2,106.1 270 top
R111  10k  [0603]  76.5,103.1 0 top
R112  1k  [0603]  131.3,83.1 90 top
R113  1k  [0603]  131.3,80.2 270 top
R114  1R  [0805]  21,34.7 270 top
R115  1R  [0805]  8.7,17.3 90 top
R116  100R  [0603]  124.4,45.5 270 top
R117  100R  [0603]  126.2,45.5 90 top
R118  2k2  [0603]  69.7,71.9 90 top
R119  100R  [0603]  128,45.5 270 top
R120  10k  [0603]  103.7,100 270 top
R121  300k  [0603]  121.2,63.7 270 top
R122  1k  [0603]  125.7,63.7 90 top
R123  1k  [0603]  131.7,55.6 180 top
R124  1k  [0603]  131.7,54.1 0 top
R125  100k  [0603]  33.6,42.7 270 top
R126  1M  [0603]  32.1,42.7 90 top
R127  1R  [0805]  28.9,42.9 270 top
R128  10k  [0603]  49,91.2 0 top
R129  0R  [0603]  66.3,58.9 270 top
R130  10k  [0603]  19.8,50.3 180 top
R131  10k  [0603]  20.6,51.8 180 top
R132  100R  [0603]  127.4,56.8 0 top
R133  261k  [0603]  118.9,46.4 90 top
R134  62k  [0603]  119.4,50.4 0 top
R135  10k  [0603]  119.6,48.6 0 top
R136  47k  [0603]  118,41.5 0 top
R137  10k  [0603]  115.1,41.1 0 top
R138  1M  [0603]  95.1,57.9 0 top
R139  1M  [0603]  101,34.7 180 top
R140  300k  [0603]  95.7,56.4 180 top
R141  10k  [0603]  95.7,50.4 180 top
R142  100k  [0603]  92.2,56.4 0 top
R143  1R  [0805]  91.9,54.7 180 top
R144  1M  [0603]  93.6,34.5 0 top
R145  1M  [0603]  93.6,32.9 180 top
R146  1M  [0603]  91.4,33.7 90 top
R147  10k  [0603]  130.9,102.4 90 top
R148  10k  [0603]  88.9,44.8 180 top
R149  100k  [0603]  93.6,47.1 0 top
R150  100k  [0603]  94.4,41.5 270 top
R151  100R  [0603]  20.6,48.8 0 top
R152  100R  [0603]  18.4,48.1 270 top
R153  100R  [0603]  36.1,36.6 270 top
R154  100R  [0603]  36.1,38.9 180 top
REF1  REF  [REF]  135.6,20.5 0 top
REF2  REF  [REF]  5.9,105.3 0 top
T1  PIC-RPX  [TEMP-PAD]  66,89.2 0 top
T2  PIC-OUT  [TEMP-PAD]  76.8,78.1 0 top
T3  PIC-RPX  [TEMP-PAD]  72.3,78.6 90 top
T4  PIC-OUT  [TEMP-PAD]  75.3,96.6 90 top
T5  PIC-RPX  [TEMP-PAD]  65.5,89.6 0 top
T6  PIC-RPX  [TEMP-PAD]  74.8,96.6 90 top
T7  PIC-OUT  [TEMP-PAD]  79.8,78.5 0 top
T8  PIC-RPX  [TEMP-PAD]  70.3,96.4 90 top
T9  PIC-RPX  [TEMP-PAD]  69.3,96.3 90 top
T10  PIC-RPX  [TEMP-PAD]  72.6,96.5 0 top
T11  PIC-OUT  [TEMP-PAD]  73.2,96.5 90 top
T12  PIC-RPX  [TEMP-PAD]  66.1,84.2 90 top
T16  PIC-RPX  [TEMP-PAD]  66.4,84.5 90 top
T17  PIC-OUT  [TEMP-PAD]  66,88.2 90 top
T18  PIC-OUT  [TEMP-PAD]  69.1,78.3 90 top
T19  PIC-RPX  [TEMP-PAD]  70.8,78.2 90 top
T20  PIC-OUT  [TEMP-PAD]  66,88.7 90 top
T21  PIC-RPX  [TEMP-PAD]  66.1,83.2 90 top
T23  PIC-OUT  [TEMP-PAD]  71.8,78.2 90 top
T24  PIC-OUT  [TEMP-PAD]  71.3,78.6 90 top
T25  PIC-OUT  [TEMP-PAD]  76.3,78.1 90 top
T26  PIC-RPX  [TEMP-PAD]  84.4,83.7 90 top
T28  PIC-RPX  [TEMP-PAD]  84.5,85.2 90 top
T29  PIC-OUT  [TEMP-PAD]  81.1,78.4 90 top
T30  PIC-OUT  [TEMP-PAD]  84.4,82.2 90 top
T31  PIC-RPX  [TEMP-PAD]  84.4,83.2 90 top
T34  PIC-RPX  [TEMP-PAD]  84.4,82.7 90 top
T35  PIC-OUT  [TEMP-PAD]  77.3,78.1 90 top
T45  PIC-RPX  [TEMP-PAD]  75.8,78.1 180 top
T46  PIC-OUT  [TEMP-PAD]  77.8,78.1 90 top
T47  PIC-OUT  [TEMP-PAD]  78.3,78.1 90 top
T48  PIC-RPX  [TEMP-PAD]  79,78.1 90 top
T49  PIC-OUT  [TEMP-PAD]  78.3,95.8 270 top
T50  PIC-RPX  [TEMP-PAD]  77.5,96.7 90 top
T57  PIC-RPX  [TEMP-PAD]  69.8,96.4 0 top
T61  PIC-OUT  [TEMP-PAD]  85.1,89.7 0 top
T62  PIC-RPX  [TEMP-PAD]  84.8,90.1 0 top
TP1  DNP-TestPoint  [SMD_ROUND_1MM]  38,83.8 90 top
TP2  DNP-TestPoint  [TH_ROUND_14MM08MM]  4.8,72.6 90 top
X1  8MHz-5x3.2mm  [7B]  59.6,82.5 90 top

## Tracks (layer width: path | path; a pad name or v marks a point on that pad's centre or on a via)
3.3V2PWRON-ICB
  Top 0.2: J1.14 136.4,83.3 134.1,83.3 133.1,84.3 133.1,85.7 132.7,86.1 Q9.5
3.3V-BT
  Top 0.4: R38.1 10.15,90.9 J14.2 10.25,90.9 C42.1
+3,3V-FILT
  Top 0.4: R28.1 59,54.2 C35.1 58.6,52.2 IC6.5
+3.3V  (via drill 0.3 pad 0.8)
  Top 0.2: R105.2 106.4,90.4 | C70.1 R82.1 | 71.3,95.8 IC1.46 71.3,93.4 | 68.9,91.2 IC1.55 | 75.8,93.4 IC1.37 | 81.5,88.7 IC1.16 | 81.7,81.7 IC1.2 | 74.3,80.8 IC1.86 | 68.9,87.7 IC1.62 | 111,99.3 111.8,98.5 111.8,94.7 111.2,94.1 | v95.2,98.1 R91.2 95.5,97.2 R3.1 | C48.1 71.2,100.3 R104.1
  Top 0.28: IC1.62 63.7,87.7 C47.1 | 84.3,81.5 84.1,81.7 IC1.2 | 84.3,88.5 84.3,88.7 IC1.16 | IC1.37 75.8,96.2 76,96.2 | 76,98.2 76,98.6 C49.1 | IC1.86 74.3,76.5 75,75.8 C52.1
  Top 0.3: C69.1 108.4,89.4
  Top 0.4: C48.1 71.3,98.9 71.3,95.8 | R103.2 v61.2,46.3 | 90.5,106.34 90.5,98.9 v90.3,98.7 | v23.1,29.6 23.1,34.9 22.3,35.7 R114.1 | R38.2 7.2,87.6 9,85.8 28.3,85.8 v34.1,80 | R132.1 v125.5,56.8 125.1,56.8 122.2,59.7 113.9,59.7 111.9,61.7 104.8,61.7 103.3,60.2 101.1,60.2 100.6,60.7 91.7,60.7 91.7,58.2 C108.1 R142.1 91.2,56.2 91.2,55 R143.2 | R117.2 v126.2,49.1 | R115.2 v8.7,24.8 | v62.8,47.9 R28.2 v62.8,57.2 | J17.2 93.26,109.1 90.5,106.34 | R92.1 88.04,108.8 90.5,106.34 | R52.2 C43.1 R51.1 | R127.2 C82.1 R126.1
  Top 0.6: C70.1 111,99.3 | R106.2 111.2,94.1 | R65.1 110.4,89.4 | 75,98.6 C49.1
  Top 0.68: C51.1 87.1,78.7 84.3,81.5 | C50.1 84.3,88.5 | 76,96.2 76,98.2
  Top 0.72: 81.6,93.5 82.2,94.1 | 81.6,80.9 82.2,80.3
  Top 0.8: R65.1 C69.1 v106.6,89.4 | v106.6,89.4 R105.2 | 81.7,81.7 80.8,81.7 | 80.8,81.7 80.5,82 | 80.5,82 80.5,88.7 | 80.5,88.7 80.5,92.4 | 80.5,92.4 81.6,93.5 | 82.2,94.1 83,94.9 84.4,94.9 86.9,97.4 88.24,97.4 C81.+ 88.94,98.1 v90.3,98.1 v90.3,98.7 89.2,98.7 | 80.5,82 74.3,82 | 74.3,82 74.3,80.8 | 80.5,92.4 75.6,92.4 | 75.6,92.4 71.3,92.4 | 71.3,92.4 70.1,91.2 | 70.1,91.2 70.1,87.7 | 68.9,87.7 70.1,87.7 | 70.1,91.2 68.9,91.2 | 71.3,92.4 71.3,93.4 | 75.8,93.4 75.8,92.6 75.6,92.4 | 81.5,88.7 80.5,88.7 | 111.2,94.1 111.6,93.7 111.6,90.6 110.4,89.4 | 66.3,60.7 65.7,60.7 v62.8,57.8 v62.8,57.2 | 66.3,60.7 v82.1,60.7 v82.7,60.7 91.7,60.7 | 80.8,81.7 81.6,80.9 | 82.2,80.3 84,78.5 84,75.8 83.6,75.4 C109.1 82.8,75.4 v82.7,75.3 v82.7,75.8 | v106.6,89.4 v106,89.4 | v33.4,57.2 v33.4,56.6 25.8,56.6 24,54.8 19.1,54.8 13.2,48.9 13.2,43.3 15.7,40.8 15.7,37.9 16.4,37.2 19.5,37.2 R114.1 | 74.3,82 71.4,82 70.1,83.3 70.1,87.7 | R129.1 66.3,60.7 | v33.4,52 v33.4,51.4 R52.2 | v28.9,41 v28.9,40.4 R127.2
  Bottom 0.4: v34.1,80 34.1,65.2 33.4,64.5 v33.4,57.2 | v126.2,49.1 125.5,49.8 v125.5,56.8 | v61.2,46.3 v62.8,47.9 | v23.1,29.6 21,27.5 10.2,27.5 8.7,26 v8.7,24.8
  Bottom 0.8: v82.7,75.8 v82.7,75.3 v82.7,60.7 v82.1,60.7 | v90.3,98.7 v90.3,98.1 v95.2,98.1 96.8,96.5 96.8,92.7 100.1,89.4 v106,89.4 v106.6,89.4 | v62.8,57.8 v62.8,57.2 58,57.2 56.3,55.5 46.6,55.5 44.9,57.2 v33.4,57.2 v33.4,56.6 v33.4,52 v33.4,51.4 33.4,45.5 v28.9,41 v28.9,40.4
+3.3V-ULTRASONIC
  Top 0.4: IC27.4 31.05,34.95 31.2,35.1 C44.2 32.6,38.6 34.8,40.8 34.8,44.2 34.4,44.6 32.5,44.6 | Q1.6 31.85,44.85 32.1,44.6 32.5,44.6 | Q1.P1 32.3,46.2 32.5,46 32.5,44.6
  Top 0.6: IC27.4 31.05,31.52 J16.3
+3.3V/1  (via drill 0.3 pad 0.8)
  Top 0.2: R27.1 R26.1 41.4,88.1 43.66,88.1 IC24.8 43.61,88.59 | IC11.2 38.95,94.25 | 38.95,94.25 39.6,93.6 | R18.1 36.65,94.25 38.95,94.25 | R25.2 103.6,83.5 104.2,82.9 105.32,82.9 IC9.3 109.06,82.86 110.34,84.13 IC9.7 111.84,84.13 112.1,84.4 v112.1,85.4 | IC24.7 44.3,89.5 44,89.8
  Top 0.4: 107.25,95.1 Q2.P2 v106.5,95.1 v106.5,95.6 106.5,96.6 106.7,96.8 107.1,96.8 107.25,96.65 Q2.3 | IC11.8 39.6,93.6 C28.1 44.6,93.6 45.1,93.1 45.1,92.3 44.95,92.15 IC7.8 44.95,90.5 | v49.6,65.1 49.9,64.8 56.5,64.8 58.8,67.1 74.7,67.1 75.3,67.7 84.6,67.7 85.9,66.4 113.9,66.4 v114.3,66.8 | v47.7,79.9 47.9,80.1 47.9,88.8 46.2,90.5 44.95,90.5 | IC9.8 110.2,85.41 C27.1 | IC24.8 43.66,89.46 44,89.8 44.7,90.5 44.95,90.5
  Top 0.6: IC9.8 v112.09,85.41 v112.1,85.4
  Bottom 0.4: v106.5,95.1 106.5,94.2 107.5,93.2 111,93.2 111.4,92.8 111.4,86.1 v112.1,85.4 112.1,82.1 114.3,79.9 v114.3,66.8 | v49.6,65.1 49.8,65.3 49.8,78.5 49,79.3 48.3,79.3 v47.7,79.9
+3.3V/2  (via drill 0.3 pad 0.8)
  Top 0.2: IC21.5 122.35,69.35
  Top 0.4: Q2.P1 v109.3,95.1 v109.3,94.6 | Q2.6 108.55,93.55 108.7,93.4 109.1,93.4 | IC21.5 124.4,69.7 | 124.4,69.7 C97.2 124.4,71.15 IC2.5 | IC18.5 124.95,69.7 | 124.95,69.7 124.4,69.7 | 122.35,69.35 122.35,69.15 122.05,68.85 IC5.5 v119.7,68.1 | 124.95,69.7 125.8,69.7 R55.1 | IC12.8 44.16,43.76 R30.2 44.2,43.9 45.8,45.5 R34.1 C41.1 R72.1 45.8,49.7 43.9,51.6 C86.+
  Top 0.6: 109.1,93.4 109.3,93.6 v109.3,94.6
  Top 0.8: v118.8,64.7 v118.4,64.3 60.2,64.3 56.2,60.3 49.2,60.3 43.9,55 C86.+
  Bottom 0.8: v118.4,64.3 v118.8,64.7 119.7,65.6 v119.7,68.1 119.7,68.5 116.8,71.4 116.8,82.2 112.2,86.8 112.2,93.2 110.8,94.6 v109.3,94.6
+3.3V/3
  Top 0.2: R150.2 95.5,40.7 | C111.1 94.5,34.6 R144.2
  Top 0.4: C111.1 94.8,37.2 95.5,37.9 95.5,40.7 95.5,43.8 94.4,44.9 C112.+ | C112.+ 94.4,44.8 | C112.+ R149.2 94.4,49.1 93.5,50 | Q13.P1 93.4,51.5 93.5,51.4 93.5,50 | Q13.6 92.75,50.15 92.9,50 93.5,50
  Top 0.6: C111.1 92.65,37.2 92.61,37.16 IC31.8
+3.3V/I2C
  Top 0.2: R130.1 21.4,50.3 | 21.4,50.3 24.1,47.6 | R131.1 21.4,50.3
  Top 0.4: IC28.4 22.55,44.85 22.8,45.1 C87.2 24.1,47.6 24.3,47.8 29.9,47.8 | Q1.3 30.55,47.55 30.3,47.8 29.9,47.8 | Q1.P2 30.1,46.2 29.9,46.4 29.9,47.8
  Top 0.6: IC28.4 22.55,41.52 J22.3
+3.3V/ICB  (via drill 0.3 pad 0.8)
  Top 0.2: R54.2 124.2,64.3 124.1,64.3 C80.1 | v132.9,73.5 132.2,73.5 131.7,74 131.7,75.2 131.15,75.75 IC20.1 | v131.2,98.7 R53.2 | C80.1 122.7,62.2 123.6,61.3 129,61.3 129.65,60.65 IC19.1 130.85,60.65 131.5,60 133.3,60 v133.4,60.1 | C80.1 R121.2
  Top 0.3: v121.3,98.3 121.2,98.3 121.2,97.72 | 121.2,97.72 IC29.3 116.88,97.72 C96.1 | 121.2,96.42 IC29.24 125.18,96.42 C91.1 | 121.2,96.42 121.2,97.72 | 121.2,93.17 IC29.19 125.28,93.17 C95.1 | 121.2,93.17 121.2,96.42 | 121.2,93.17 IC29.10 116.83,93.17 C93.1 | R53.2 131.1,99.7 131.1,101.4 R147.1
  Top 0.4: J6.1 C116.1 R110.1 79.8,107.5 79.8,110.2 80.6,111 115.1,111 121.7,104.4 C92.1
  Top 0.8: C92.1 v121.7,98.7 v121.3,98.3 | v131.2,98.7 v131.6,98.3 132.9,97 v132.9,93.7 v132.9,93.1
  Bottom 0.8: J1.33 133.54,56.66 132.9,57.3 132.9,60.1 | v133.4,60.1 132.9,60.1 | 132.9,60.1 v132.9,73.5 v132.9,93.1 v132.9,93.7 | v121.3,98.3 v121.7,98.7 v131.2,98.7 v131.6,98.3
+3.3VCCR
  Top 0.4: J5.9 C78.2 9.6,15.4 R115.1
/3.3V1PWRON  (via drill 0.3 pad 0.8)
  Top 0.2: IC1.21 83.9,91.2 84.2,90.9 89.7,90.9 92.4,88.2 92.4,83.6 98.3,77.7 100.7,77.7 v101,78 | v101,80.3 100.7,80.6 100.7,87.6 104.1,91 v105.2,91 | R24.2 v110.6,92.4
  Bottom 0.2: v101,78 v101,80.3 | v110.6,92.4 106.6,92.4 v105.2,91
/3.3V2PWRON  (via drill 0.3 pad 0.8)
  Top 0.2: R75.2 106.4,97.8 R60.2 105.8,97.7 105.2,97.1 105.2,92.7 100.3,87.8 100.3,80.8 v99.9,80.4 | IC1.96 79.3,78.4 80.4,77.3 80.4,73.3 80.8,72.9 96.2,72.9 97.7,71.4 99.5,71.4 v99.8,71.7
  Bottom 0.2: v99.8,71.7 99.5,72 99.5,78 99.9,78.4 v99.9,80.4
/BTN1  (via drill 0.3 pad 0.8)
  Top 0.2: IC1.5 O6.P$1 T31.P$1 84.8,83.2 90.6,77.4 93.2,77.4 94.2,76.4 v94.2,76 | v96.4,85.3 95.2,86.5 95.2,91.6 96,92.4 102.2,92.4 103.4,93.6 103.4,98.9 R120.2 | v99.1,59.7 99.8,59 105.6,59 108.6,56 120.6,56 127.1,49.5 127.1,43.9 112.2,29 108.7,29 108.55,28.85 IC22.4
  Bottom 0.2: v99.1,59.7 97.9,60.9 97.9,64.2 94.6,67.5 94.6,73.5 94.2,73.9 v94.2,76 94.2,78.7 96.1,80.6 96.1,85 v96.4,85.3
/BTN2  (via drill 0.3 pad 0.8)
  Top 0.2: R71.2 104.6,101.5 104.6,98.5 103.8,97.7 103.8,93.4 102.4,92 96.2,92 95.6,91.4 95.6,86.8 96,86.4 v96.4,86.4 | v93.1,76.5 92.6,77 90.4,77 84.7,82.7 T34.P$1 O7.P$1 IC1.4 | IC23.4 103.85,29.25 104.7,30.1 111.7,30.1 125.3,43.7 125.3,50.7 120.4,55.6 108.4,55.6 105.4,58.6 99.2,58.6 v98.1,59.7
  Bottom 0.2: v98.1,59.7 97.5,60.3 97.5,64 94.2,67.3 94.2,73.3 93.1,74.4 v93.1,76.5 93.1,78.2 95.7,80.8 95.7,85.7 v96.4,86.4
/CL_CS  (via drill 0.3 pad 0.8)
  Top 0.2: J5.7 9.9,13.1 6.3,16.7 6.3,50.4 11.3,55.4 11.3,69.7 14.1,72.5 14.1,74.3 14.7,74.9 25.4,74.9 v25.8,75.3 | IC1.38 O17.P$1 T4.P$1 75.3,96.8 73.6,98.5 73.6,102.9 72.1,104.4 65.4,104.4 50.7,89.7 50.7,78.9 48.4,76.6 27.1,76.6 26.9,76.4 24.8,76.4 v24.4,76
  Bottom 0.2: v24.4,76 25.1,76 v25.8,75.3
/FAULT-AUDIO  (via drill 0.3 pad 0.8)
  Top 0.2: 131.3,32.7 R7.1 131.3,35.9 130.8,36.4 130.8,48.8 121.6,58 111.2,58 v108.9,60.3 | IC1.95 O3.P$1 78.8,78.3 T48.P$1 80,77.1 80,73.1 80.6,72.5 96,72.5 97.5,71 100.8,71 101.2,71.4 107.4,71.4 v108.9,69.9
  Bottom 0.2: v108.9,69.9 v108.9,60.3
/FMEM1-CS  (via drill 0.3 pad 0.8)
  Top 0.2: IC1.11 85.4,86.2 88.5,83.1 89.9,83.1 97.3,75.7 110.1,75.7 v110.7,76.3 | R25.1 IC9.1 106,85.4 107.7,83.7 v108.6,83.7
  Bottom 0.2: v110.7,76.3 110.7,79 108.6,81.1 v108.6,83.7
/I2C_PWRON  (via drill 0.3 pad 0.8)
  Top 0.2: v81.1,73.7 80.8,74 80.8,77.5 O29.P$1 T7.P$1 IC1.97 | v81.5,66.9 77.9,66.9 77.6,67.2 75.6,67.2 75,66.6 59.1,66.6 56.8,64.3 39.9,64.3 38.5,62.9 38.5,54.1 36.9,52.5 36.9,41.4 v37.2,41.1 | R125.2 v33.6,41.1
  Bottom 0.2: v81.1,73.7 81.8,73 81.8,67.2 v81.5,66.9 | v33.6,41.1 v37.2,41.1
/INT-TOUCH  (via drill 0.3 pad 0.8)
  Top 0.2: J6.5 71,108.6 74.7,112.3 115.8,112.3 131.2,96.9 131.2,93.4 v131.9,92.7
  Bottom 0.2: J1.38 136.41,52.8 132.8,52.8 131.1,54.5 131.1,91.9 v131.9,92.7
/LD_SM  (via drill 0.3 pad 0.8)
  Top 0.2: 9.65,34.45 IC17.25 9.55,34.45 9.5,34.5 9.5,48.8 14.5,53.8 14.5,68 15.5,69 29.4,69 v29.9,69.5 | v31.1,72.1 31.4,72.4 34,72.4 35.6,70.8 37.1,70.8 37.9,71.6 53.6,71.6 56.5,74.5 56.5,85.8 59.1,88.4 64.5,88.4 64.7,88.2 T17.P$1 O39.P$1 IC1.61
  Bottom 0.2: v29.9,69.5 29.9,70.9 v31.1,72.1
/MCLR  (via drill 0.3 pad 0.8)
  Top 0.2: IC1.13 86.2,87.2 v86.5,86.9 | v88.1,94.8 90.1,94.8 91.8,96.5 91.8,99.6 R90.2 R61.2 92.1,102 v92.1,105.6
  Bottom 0.2: v88.1,94.8 88.1,88.5 v86.5,86.9 | J17.1 92.1,107.82 v92.1,105.6
/MCLR2
  Top 0.2: IC3.6 98.75,98.35 98.9,98.2 99.5,98.2 100,97.7 102.2,97.7 102.8,97.1 102.8,95.42 J10.1
/RESET-ICB-OUT  (via drill 0.3 pad 0.8)
  Top 0.2: v125.8,89.8 125.4,89.8 124.3,88.7 124.3,83.4 119.2,78.3 106.8,78.3 105.4,76.9 97.9,76.9 91.6,83.2 91.6,87.8 89.3,90.1 T62.P$1 O11.P$1 83.8,90.1 83.7,90.2 IC1.19
  Bottom 0.2: v125.8,89.8 127.8,91.8 127.8,94.1 129.7,96 136.39,96 J1.4
/RESET-TOUCH  (via drill 0.3 pad 0.8)
  Top 0.2: J6.6 70,108.2 74.5,112.7 116,112.7 131.6,97.1 131.6,94 v131.9,93.7
  Bottom 0.2: J1.39 130.7,53.43 130.7,92.5 v131.9,93.7
/RST-IN  (via drill 0.3 pad 0.8)
  Top 0.2: Q9.6 131.8,87.9 131.5,88.2 128.5,88.2 v125.8,90.9 125.58,91.12 124.98,91.12 124.88,91.22 IC29.16 | J1.1 R53.1
  Bottom 0.2: v125.8,90.9 126.3,90.9 127.4,92 127.4,94.3 129.5,96.4 134.19,96.4 J1.1
/SD-AUDIO  (via drill 0.3 pad 0.8)
  Top 0.2: R6.1 129.8,34 R84.2 130.4,34.8 130.4,48.6 121.4,57.6 110.4,57.6 107.8,60.2 v107.8,60.3 | IC1.94 O4.P$1 T47.P$1 79.6,76.8 79.6,72.9 80.4,72.1 95.8,72.1 97.3,70.6 101.1,70.6 101.5,71 106.7,71 v107.8,69.9
  Bottom 0.2: v107.8,69.9 v107.8,60.3
/SM_FAULT  (via drill 0.3 pad 0.8)
  Top 0.2: IC1.71 O24.P$1 T21.P$1 65.6,83.2 64.6,82.2 64.6,78.8 61.3,75.5 59.3,75.5 54.2,70.4 38.5,70.4 37.7,69.6 35,69.6 33.7,70.9 v32.7,70.9 | v31.1,69.5 30.2,68.6 15.7,68.6 14.9,67.8 14.9,53.6 9.9,48.6 9.9,36.1 10.1,35.9 10.8,35.9 10.95,35.75 IC17.24
  Bottom 0.2: v32.7,70.9 31.3,69.5 v31.1,69.5
/TWI_WAKEUP  (via drill 0.3 pad 0.8)
  Top 0.2: J1.17 135.02,76.98 134.1,77.9 128.3,77.9 v127.9,77.5 | IC29.22 124.78,95.12 124.9,95 127.1,95 129.4,92.7 129.4,90.3 v129,89.9
  Bottom 0.2: v127.9,77.5 127.9,78.1 128.2,78.4 128.2,80.6 129.3,81.7 129.3,89.6 v129,89.9
/USNC-PWRON
  Top 0.2: IC1.80 T24.P$1 O30.P$1 71.3,78.1 67.9,74.7 64.7,74.7 62.7,72.7 60.7,72.7 55.6,67.6 45.4,67.6 44.8,67 38,67 37.3,66.3 37.3,62.8 36.1,61.6 36.1,55.3 34.5,53.7 31.3,53.7 28.7,51.1 R50.2
A+  (via drill 0.3 pad 0.8)
  Top 0.2: 42.8,20.6 IC14.3 43.05,20.45 43.8,21.2 43.8,25.1 43.2,25.7 L8.2
  Top 0.4: IC14.3 43.08,20.45 43.08,18.55 43.77,17.86
  Top 1: J3.4 43.77,17.86 45.6,19.7 v60.9,19.7 v61.5,19.7
  Bottom 1: J4.4 61.57,19.63 v61.5,19.7 v60.9,19.7
A++
  Top 0.2: R34.2 43.7,45.1 41,45.1 40.17,44.27 IC12.6 40.17,43.33 41.4,42.1 43.2,42.1 45.7,39.6 45.7,35.2 42.5,32 40.5,32 39.6,31.1 R32.2 38.9,30.3 38.9,28.3 39.3,27.9 41.5,27.9 42.5,28.9 L8.1
AUD-AVCC  (via drill 0.3 pad 0.8)
  Top 0.3: IC25.7 124.53,27.62 | 124.53,27.62 124.53,28.32 125,28.8 C11.1 | 124.53,27.62 123.53,28.62
  Top 0.4: C19.1 C11.1 | 124.9,29.2 C11.1 | R4.2 117.4,31.2 v118,31.8 118.7,32.5 R5.1 | v124.8,31.4 125,31.2 C11.1
  Bottom 0.4: v118,31.8 124.4,31.8 v124.8,31.4
AUD_AMP_FAULT#
  Top 0.2: R7.2 R6.2 129.8,30.1 129.9,30 129.9,27.97 129.33,27.4 128.4,27.4 | IC25.2 127.78,27.37 127.8,27.4 128.4,27.4 | 128.4,27.4 128.4,26.52 IC25.1
AUD_GVDD
  Top 0.2: IC25.10 122.58,27.4 | 122.58,27.4 122.58,27.72 122.3,28 122.3,30.2 123.4,31.3 C12.1 | IC25.9 123.23,27.37 123.2,27.4 122.58,27.4
  Top 0.4: C118.1 124.3,32.5 C12.1
AUD_IN+
  Top 0.2: IC25.12 121.28,30.02 C20.2
AUD_IN-
  Top 0.2: IC25.11 121.93,27.57 121.8,27.7 121.8,31.1 C21.2
AUDIO-IN
  Top 0.4: C20.1 120.4,33 125.63,38.23 J13.2
AUDIO-PWRON  (via drill 0.3 pad 0.8)
  Top 0.2: Q6.5 80.1,25.4 R13.1 79.4,28.4 80.2,29.2 83.2,29.2 85.6,31.6 85.6,58.4 v86.8,59.6 | IC1.90 O14.P$1 T25.P$1 76.3,77.7 78,76 78,71.8 80.3,69.5 86.6,69.5 87.5,68.6 v89.3,68.6
  Bottom 0.2: v89.3,68.6 89.3,62.1 v86.8,59.6
AVDD
  Top 0.2: 79.3,98.4 C55.1
  Top 0.28: IC1.30 79.3,96.7 79.1,96.9
  Top 0.4: C55.1 79.3,98.6 78.5,99.4 78.5,102.9 C88.1 C56.+ L13.2
  Top 0.6: 79.1,96.9 79.1,98.2 C55.1
B-  (via drill 0.3 pad 0.8)
  Top 0.2: 40.15,20.45 39.4,21.2 39.4,25.1 40,25.7 L7.2
  Top 0.4: v39.2,12 37.8,13.4 37.8,18.1 40.15,20.45 IC14.2
  Bottom 0.4: J3.5 42.69,12 v39.2,12
  Bottom 1: J4.5 60.48,12 46.7,12 45.04,13.66 J3.5
B--
  Top 0.2: L7.1 40.6,28.9 41.2,29.5 R32.1 R31.1 42.5,31.4 46.1,35 46.1,39.8 43.4,42.5 42.3,42.5 41.44,43.36 IC12.7
BSN
  Top 0.2: 124.5,20.9 IC25.22 124.53,19.92 124.4,19.8 124.4,15.9 124.7,15.6 129.1,15.6 129.4,15.9 129.4,17.9 129.1,18.2 127.7,18.2 127.12,18.77 127.12,19.02 | IC25.26 127.12,19.02 | 127.12,19.02 C14.2
BSP
  Top 0.2: IC25.17 121.28,18.9 C13.1 121.4,18.8 120.8,18.2 119.3,18.2 119,17.9 119,15.9 119.3,15.6 123.7,15.6 124,15.9 124,19.8 123.88,19.92 IC25.21
BT-RTS  (via drill 0.3 pad 0.8)
  Top 0.2: IC1.83 72.8,77.8 68.5,73.5 65.3,73.5 63.3,71.5 61.3,71.5 56.2,66.4 47.7,66.4 v47.4,66.1 | v47.8,77.3 47.1,78 45.3,78 43.7,79.6 39.2,79.6 19.4,99.4 14.45,99.4 J14.7
  Bottom 0.2: v47.4,66.1 47.1,66.4 47.1,76.6 v47.8,77.3
BT-RX  (via drill 0.3 pad 0.8)
  Top 0.2: IC1.73 65.8,82.2 65.4,81.8 65.4,78.4 61.7,74.7 59.7,74.7 54.6,69.6 44.4,69.6 43.8,69 43,69 v42.3,69.7 | v42.3,77.8 41.9,77.4 38.6,77.4 22.51,93.49 J14.3
  Bottom 0.2: v42.3,69.7 v42.3,77.8
BT-TX  (via drill 0.3 pad 0.8)
  Top 0.2: IC1.74 65.9,81.7 65.8,81.6 65.8,78.2 61.9,74.3 59.9,74.3 54.8,69.2 44.6,69.2 44,68.6 42.2,68.6 v41.1,69.7 | v41.1,78.1 40.8,77.8 38.9,77.8 20.67,96.03 J14.4
  Bottom 0.2: v41.1,69.7 v41.1,78.1
CL_IRQ
  Top 0.2: IC1.39 O18.P$1 T6.P$1 74.8,96.7 73.2,98.3 73.2,102.7 71.9,104 65.6,104 51.1,89.5 51.1,78.7 48.6,76.2 27.3,76.2 27.1,76 25.4,76 24.7,75.3 13.5,75.3 11.9,73.7 11.9,71.5 10.5,70.1 10.5,55.8 5.5,50.8 5.5,16.9 2.5,13.9 2.5,9.9 3.2,9.2 4.7,9.2 5.9,10.4 J5.4
CON-LED  (via drill 0.3 pad 0.8)
  Top 0.2: IC1.78 70.3,78.3 67.5,75.5 64.3,75.5 62.3,73.5 60.3,73.5 55.2,68.4 45,68.4 44.4,67.8 41,67.8 v39.6,69.2 | v39.6,78.9 39.2,78.9 19.1,99 12.31,99 J14.6
  Bottom 0.2: v39.6,69.2 v39.6,78.9
CTL-ELMAGDISP  (via drill 0.3 pad 0.8)
  Top 0.2: IC1.98 O33.P$1 80.3,78.6 81.2,77.7 81.2,74.6 82.5,73.3 89,73.3 v89.3,73.6 | IC31.2 91.34,42.77 91,43.1 90.4,43.1 90.06,42.77 IC31.3 90.06,41.77 89.3,41 88.4,41 88,41.4 88,43.2 89.6,44.8 R148.1 89.7,44.7 90.5,43.9 92.1,43.9 92.4,44.2 92.4,46 91.8,46.6 91.8,47.5 89,50.3 89,59.4 v88.8,59.6
  Bottom 0.2: v89.3,73.6 89.3,70.7 90.4,69.6 90.4,61.2 v88.8,59.6
CURR-ICB  (via drill 0.3 pad 0.8)
  Top 0.2: IC1.23 84.4,92.2 84.9,91.7 87.4,91.7 C38.1 89.2,92.6 93.2,88.6 93.2,85 v93.5,84.7 93.4,84.7 | v85.8,59.6 85.2,59 85.2,34.3 R36.2
  Bottom 0.2: v93.5,84.7 90.5,84.7 88.6,82.8 88.6,62.4 v85.8,59.6
CURR-SENSE  (via drill 0.3 pad 0.8)
  Top 0.2: C66.1 87.7,87.1 | 87.7,87.1 87.2,87.6 83.8,87.6 83.7,87.7 IC1.14 | 87.7,87.1 88.5,86.3 88.5,84.8 v89,84.3 | v84.8,59.6 84.6,59.6 84.8,59.4 84.8,35.4 83.2,33.8 R102.2
  Bottom 0.2: v89,84.3 88.2,83.5 88.2,63 v84.8,59.6
D+  (via drill 0.3 pad 0.8)
  Top 0.2: IC1.57 66.6,90.2
  Top 0.4: v50,95.6 50.75,96.35 IC15.3 51.3,96.8 52.9,98.4 52.9,99.95 J12.3_D+ | 66.6,90.2 61.2,90.2 60.1,91.3 v59.8,91.3
  Bottom 0.4: v50,95.6 50,93.1 50.7,92.4 59,92.4 59.8,91.6 v59.8,91.3
D-  (via drill 0.3 pad 0.8)
  Top 0.2: IC1.56 66.7,90.7 66.6,90.8
  Top 0.4: 66.6,90.8 61.5,90.8 60.8,91.5 v60.8,91.8 | v51.1,93.2 50.75,93.55 IC15.2 50.75,95.25 54.15,98.65 J12.2_D-
  Bottom 0.4: v51.1,93.2 51.3,93 59.3,93 60.5,91.8 v60.8,91.8
DEBUG-RXD-A  (via drill 0.3 pad 0.8)
  Top 0.2: v123,83.2 123.9,84.1 123.9,86.1 122.2,87.8 113.4,87.8 113.1,88.1 113.1,101.1 115.1,103.1 v115.6,103.1 | J1.28 137.42,64.28 136.2,65.5 127.7,65.5 v127.4,65.8 | R109.1 v121.3,109.9
  Bottom 0.2: v127.4,65.8 127.8,66.2 127.8,76 125.8,78 124.7,78 124,78.7 124,82.2 v123,83.2 | v121.3,109.9 115.6,104.2 v115.6,103.1
DEBUG-TXD-A  (via drill 0.3 pad 0.8)
  Top 0.2: v123.1,84.6 123.5,85 123.5,85.9 122,87.4 113.2,87.4 112.7,87.9 112.7,101.3 115.3,103.9 v116.3,103.9 | v127.6,64.6 134.77,64.6 J1.27 | R108.1 v121.3,108.4
  Bottom 0.2: v123.1,84.6 123.1,84.4 124.4,83.1 124.4,78.9 124.9,78.4 126,78.4 128.2,76.2 128.2,65.2 v127.6,64.6 | v121.3,108.4 120.4,108.4 116.3,104.3 v116.3,103.9
DGND  (via drill 0.3 pad 0.8)
  Top 0.2: C28.2 v41.3,96 41.3,96.9 | R21.2 76.9,42 77.6,41.3 80.7,41.3 82.2,42.8 82.2,44.4 82,44.6 79,44.6 79,45.5 | C51.2 v86.2,76.7 | 80.4,103.2 80.3,103.1 | IC11.4 37.65,96.9 v37.6,96.9 38.3,96.9 | IC7.7 v44.3,92.7 | IC11.3 38.3,96.9 | 38.3,96.9 v39.6,96.9 | 44.95,96.85 44.95,96.9 v44.9,96.9 44.3,96.9 | IC7.2 44.3,96.9 | IC7.3 43.65,96.9 | 43.65,96.9 44.3,96.9 | IC7.4 v43,96.9 | v43,96.9 43.65,96.9 | IC11.1 v39.6,96.9 | v39.6,96.9 41.3,96.9 | 41.3,96.9 v43,96.9 | v85.6,100.2 C64.2 | R8.1 v128.4,33.4 128.4,34.2 R84.1 | R10.2 R12.1 v80.6,21.6 80.1,21.6 80.1,23.4 79.4,23.4 | 16.65,30.95 16.15,31.45 IC17.10 13.95,31.45 IC17.PAD | 16.65,30.95 IC17.9 14.85,30.95 14.5,31.3 14.1,31.3 IC17.PAD | 16.65,30.95 v16.7,30.9 16.9,30.7 C2.2 | IC17.PAD 12.45,32.95 IC17.21 12.45,36.75 v12.7,37 13.2,37.5 13.2,38.8 R2.2 12.2,39.7 11.7,40.2 v11.4,40.2 | C5.2 19.3,34.7 v19.3,33.6 | 103.25,21.65 Q10.1 102.9,21.9 C46.2 | 107.15,20.35 Q10.4 104.55,20.35 104.5,20.3 v104.5,19.75 | 107.15,20.35 107.2,20.4 R83.1 | R70.1 101.1,20.1 | IC22.3 108.55,25.35 R63.2 107.9,24.4 106.5,24.4 C45.2 | 5.41,65.71 J2.C5 | C38.2 v85.9,92.6 | IC4.2 78.4,23.4 79.35,23.4 | IC4.1 79.35,23.4 | 79.4,23.4 v79.4,23.6 R13.2 | 79.35,23.4 79.4,23.4 | C71.2 R89.1 | 51.4,36.7 51.9,37.2 54.4,37.2 | C67.2 v61.2,40.2 | v59.8,33.6 59.8,35.4 | R44.2 59.8,35.3 59.75,35.25 59.55,35.25 | 65.2,24.6 v65.2,26.1 | v56.9,51.4 C35.2 58,51.2 58.1,51.2 | C29.2 v73.1,20.4 | 105.4,26.5 104,26.5 103.9,26.6 IC23.3 103.85,25.55 R74.2 104.2,25.1 C45.2 | IC19.3 130.25,59.35 130,59.1 v130,58.3 | IC5.3 123.8,66.1 v124,65.9 124,66.5 123.4,67.1 | C71.2 128.45,79.4 v129.05,80 | R57.1 126.8,80.2 | 126.8,80.2 127.5,80.2 C71.2
  Top 0.2: C6.2 v98.7,94.7 v95.2,94.7 C40.2 | IC20.3 130.35,74.45 130,74.1 v130,73.9 | 127.9,72.8 IC2.3 | IC24.4 IC24.5 | 123.6,80.2 126.8,80.2 | C45.2 104.9,22.8 v104.9,22.6 | IC24.6 44.93,89.53 45.2,89.8 45.3,89.8 45.57,89.53 IC24.5 | 122.3,93.82 122.3,94.47 122.3,95.78 IC29.23 | C95.2 125.58,91.88 | 125.48,97.72 C91.2 | 119.7,93.82 119.7,94.47 | 116.4,94.47 v116.4,95.8 C96.2 | v116.4,91.2 C93.2 | C2.2 C77.2 | 107.15,20.35 107.2,20.3 v107.2,19.9 | C2.2 v19.3,29.9 | IC30.8 117.7,43.4 118.2,43.9 118.2,44 | C105.2 120.3,45.6 | v117.4,46.4 119.6,46.4 C105.2 | C105.2 121.3,46.5 121.3,49.1 120.9,49.5 118.2,49.5 117.9,49.2 116.5,49.2 | C113.2 117.7,51.9 117.7,51.5 v116.8,51.5 | R136.2 117.9,40.6 116.4,40.6 R137.2 | R138.2 95.9,57.8 96.5,57.2 R140.1 97.1,55.8 97.1,51.8 | R141.1 96.5,50.5 97.1,51.1 97.1,51.8 | R146.1 90.6,32.9 88.8,34.7 IC31.5 | 105.3,41.95 106.5,43.15 106.5,44.8 105.8,44.8 105.8,45.2 106,45.4 | J6.2 v74,105.1 75.8,105.1 76,105.3 C116.2 | IC9.4 106.4,81.59 v106.8,82 | C27.2 106.5,86.6 v106.3,86.4 | IC24.5 v46.39,88.59 v46.4,88.6 | v99.5,51.8 97.1,51.8 | D5.K 2.1,75.4 v2.1,71.7 | v88.8,38 88.9,38 88.9,38.8
  Top 0.28: IC1.45 71.8,94 v72.3,93.5 | v76.8,93.5 76.3,94 IC1.36 | IC1.31 v78.8,93.5 | IC1.15 82.1,88.2 v81.6,87.7 | IC1.75 68.7,81.2 v69,80.9 | C51.2 v87.1,75.9 | 65.5,86.2 IC1.65 v69,86.2
  Top 0.3: IC8.10 76.5,48.1 | R19.2 R21.2 | C24.1 79.6,51.5 78,51.5 R17.2 76.45,49.95 | 60.8,78.2 60.2,77.6 | v68.8,99 C48.2 69.6,98.2 v69.7,98.1 | v124.2,10.7 v124.2,14.8 | 127.12,27.92 126.48,27.27 IC25.4 126.48,24.62 | 127.12,27.92 128.2,29 C11.2 | IC25.8 123.88,24.7 | 123.88,24.7 123.88,24.02 IC25.EP | IC25.19 122.58,22.3 | 122.58,22.3 122.58,22.77 | IC25.24 125.83,22.4 | 125.83,22.4 125.83,22.82 | IC25.3 127.12,27.92 | IC29.11 116.93,92.53 C93.2 | C96.2 116.88,97.07 IC29.4 119.53,97.07 v119.7,96.9 | IC29.11 IC29.18 | IC29.20 122.3,93.82 | IC29.18 125.18,92.53 | 125.18,92.53 C95.2 | 125.58,91.88 IC29.17 122.5,91.88 | IC29.11 119.6,92.53 v119.6,92.3 | IC29.18 122.4,92.53 v122.4,92.3 | 125.28,97.07 IC29.25 122.62,97.07 v122.4,97.3 | 125.28,97.07 C91.2 | 125.48,97.72 IC29.26 122.4,97.72 | IC29.9 119.7,93.82 | 116.4,94.47 IC29.8 119.7,94.47 | 125.28,97.07 125.78,97.07 | 125.18,92.53 125.78,92.53 | IC29.21 123.83,94.47 | 124.73,94.47 124.7,94.5 | 124.7,94.5 126.3,94.5 126.7,94.1 126.7,92.7 v126.6,92.6 | 122.3,94.47 IC29.21 | IC29.21 124.73,94.47 | 124.5,93.82 IC29.20 | 124.73,94.47 124.9,94.3 124.9,94.2 124.53,93.82 IC29.20 | IC29.21 124.68,94.47 124.7,94.5 | v123.9,25.1 123.9,24.72 123.88,24.7 | v122.6,22.3 122.58,22.3 | v125.8,22.3 125.8,22.37 125.83,22.4 | 19.9,9.1 J9.7 19.9,5.4 18.9,5.4 J9.8 18.9,8.7 19.3,9.1 19.9,9.1 | J15.8 J15.7 22.76,16.14 18.94,19.96 J21.7 J21.8 16.4,27.6 16.8,28 v16.8,29.3 | J15.8 22.76,11.96 | 19.9,9.1 21.8,11 22.6,11 22.76,11.16 J15.8 | v15.3,30.1 16,30.1 v16.8,29.3 | v16.8,29.3 19.3,29.3 v19.3,29.9
  Top 0.32: 134,52.85 136.2,52.85